# EAGLE schematic design (EAGLE 7.7.0)

## Sheet 1 of 17
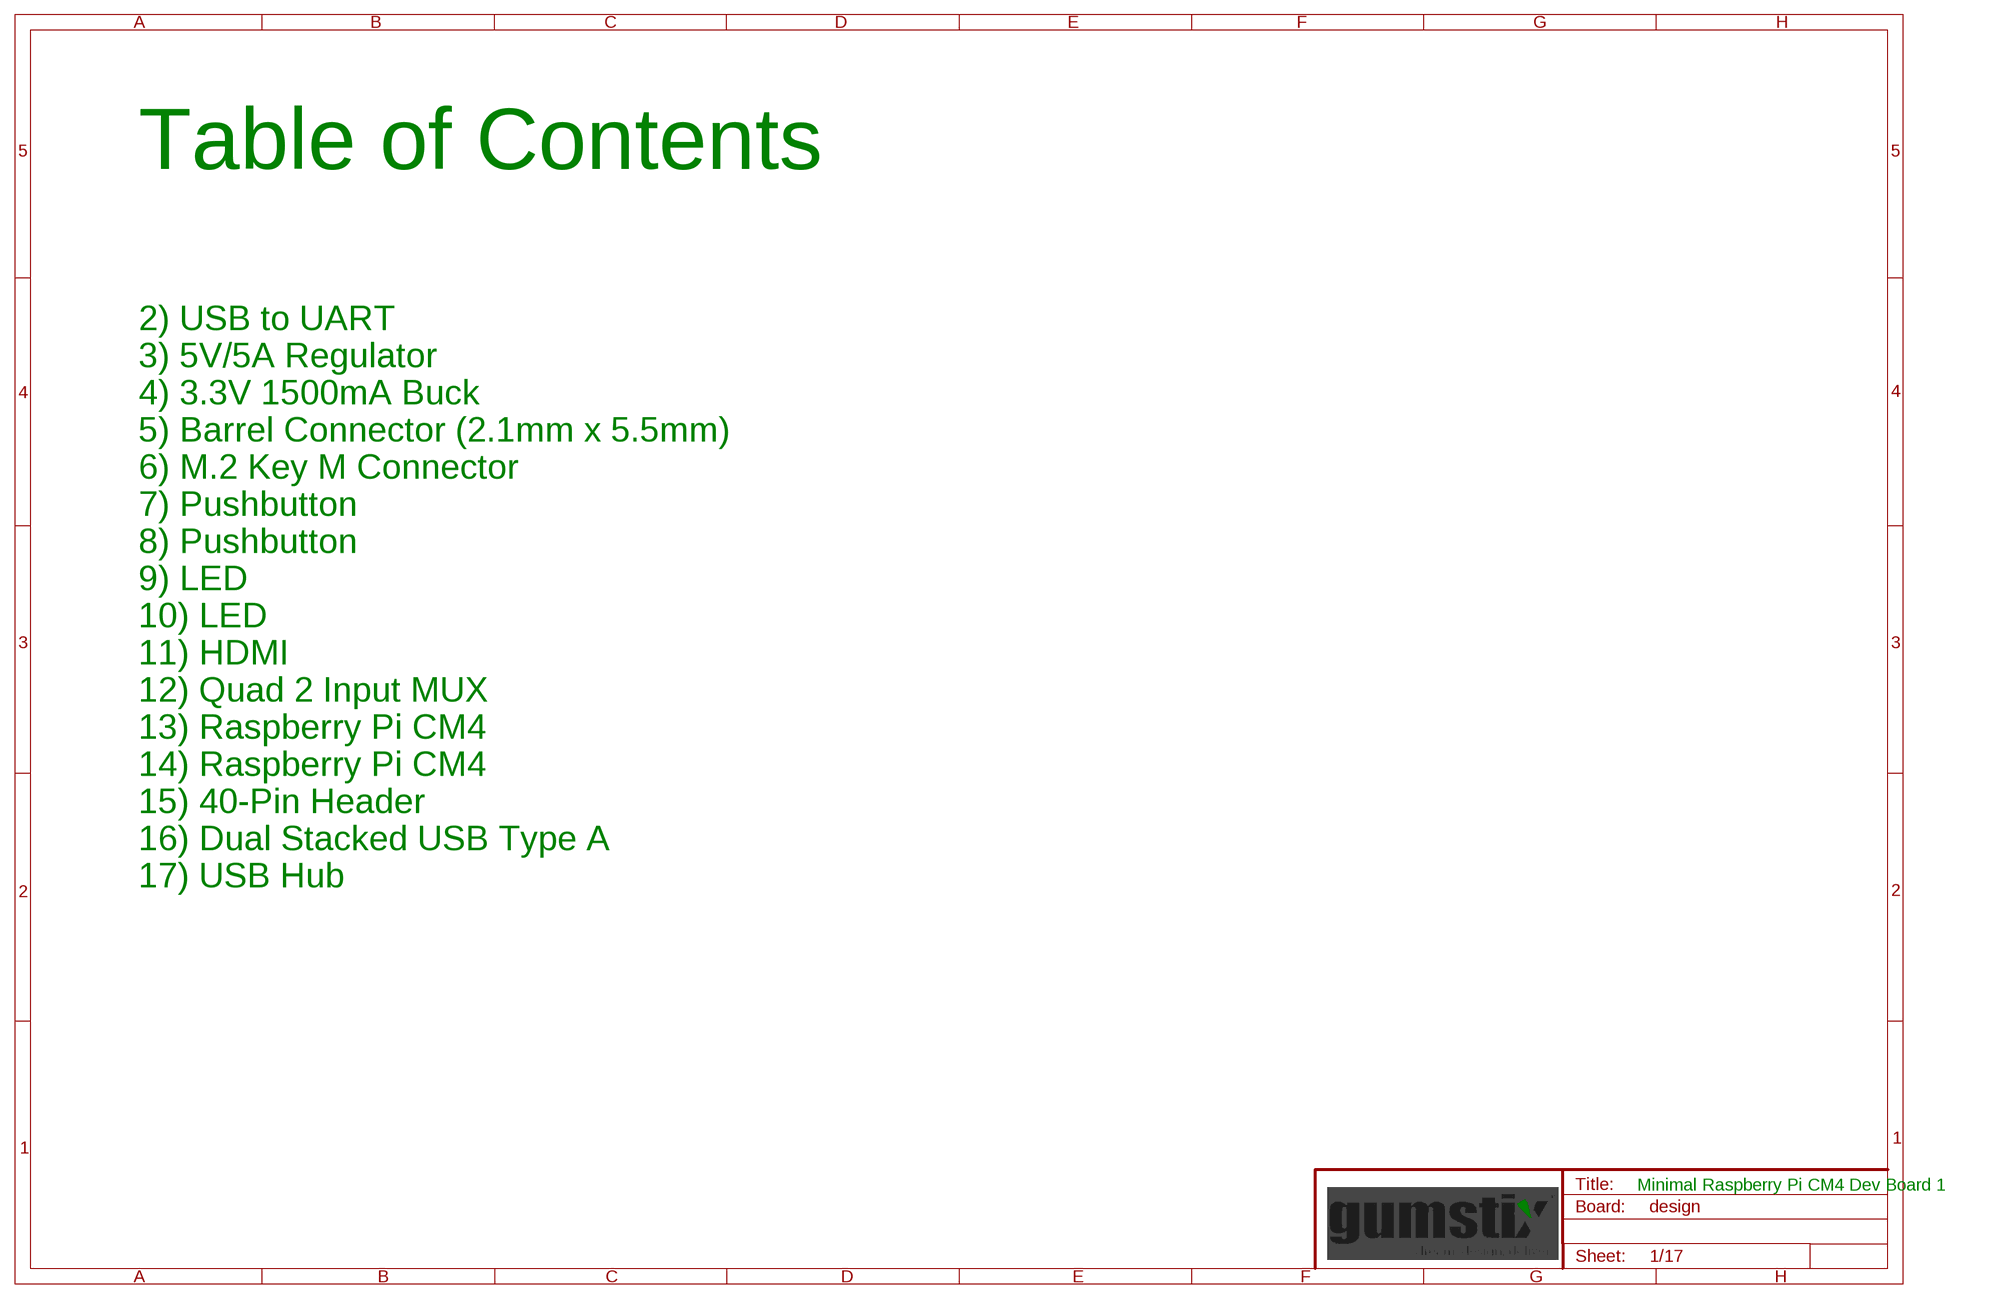
[diagram p0: schematic, sheet 1]

### Notes on the sheet
- Table of Contents
- 2) USB to UART
- 3) 5V/5A Regulator
- 4) 3.3V 1500mA Buck
- 5) Barrel Connector (2.1mm x 5.5mm)
- 6) M.2 Key M Connector
- 7) Pushbutton
- 8) Pushbutton
- 9) LED
- 10) LED
- 11) HDMI
- 12) Quad 2 Input MUX
- 13) Raspberry Pi CM4
- 14) Raspberry Pi CM4
- 15) 40-Pin Header
- 16) Dual Stacked USB Type A
- 17) USB Hub
- Minimal Raspberry Pi CM4 Dev Board 1

## Sheet 2 of 17
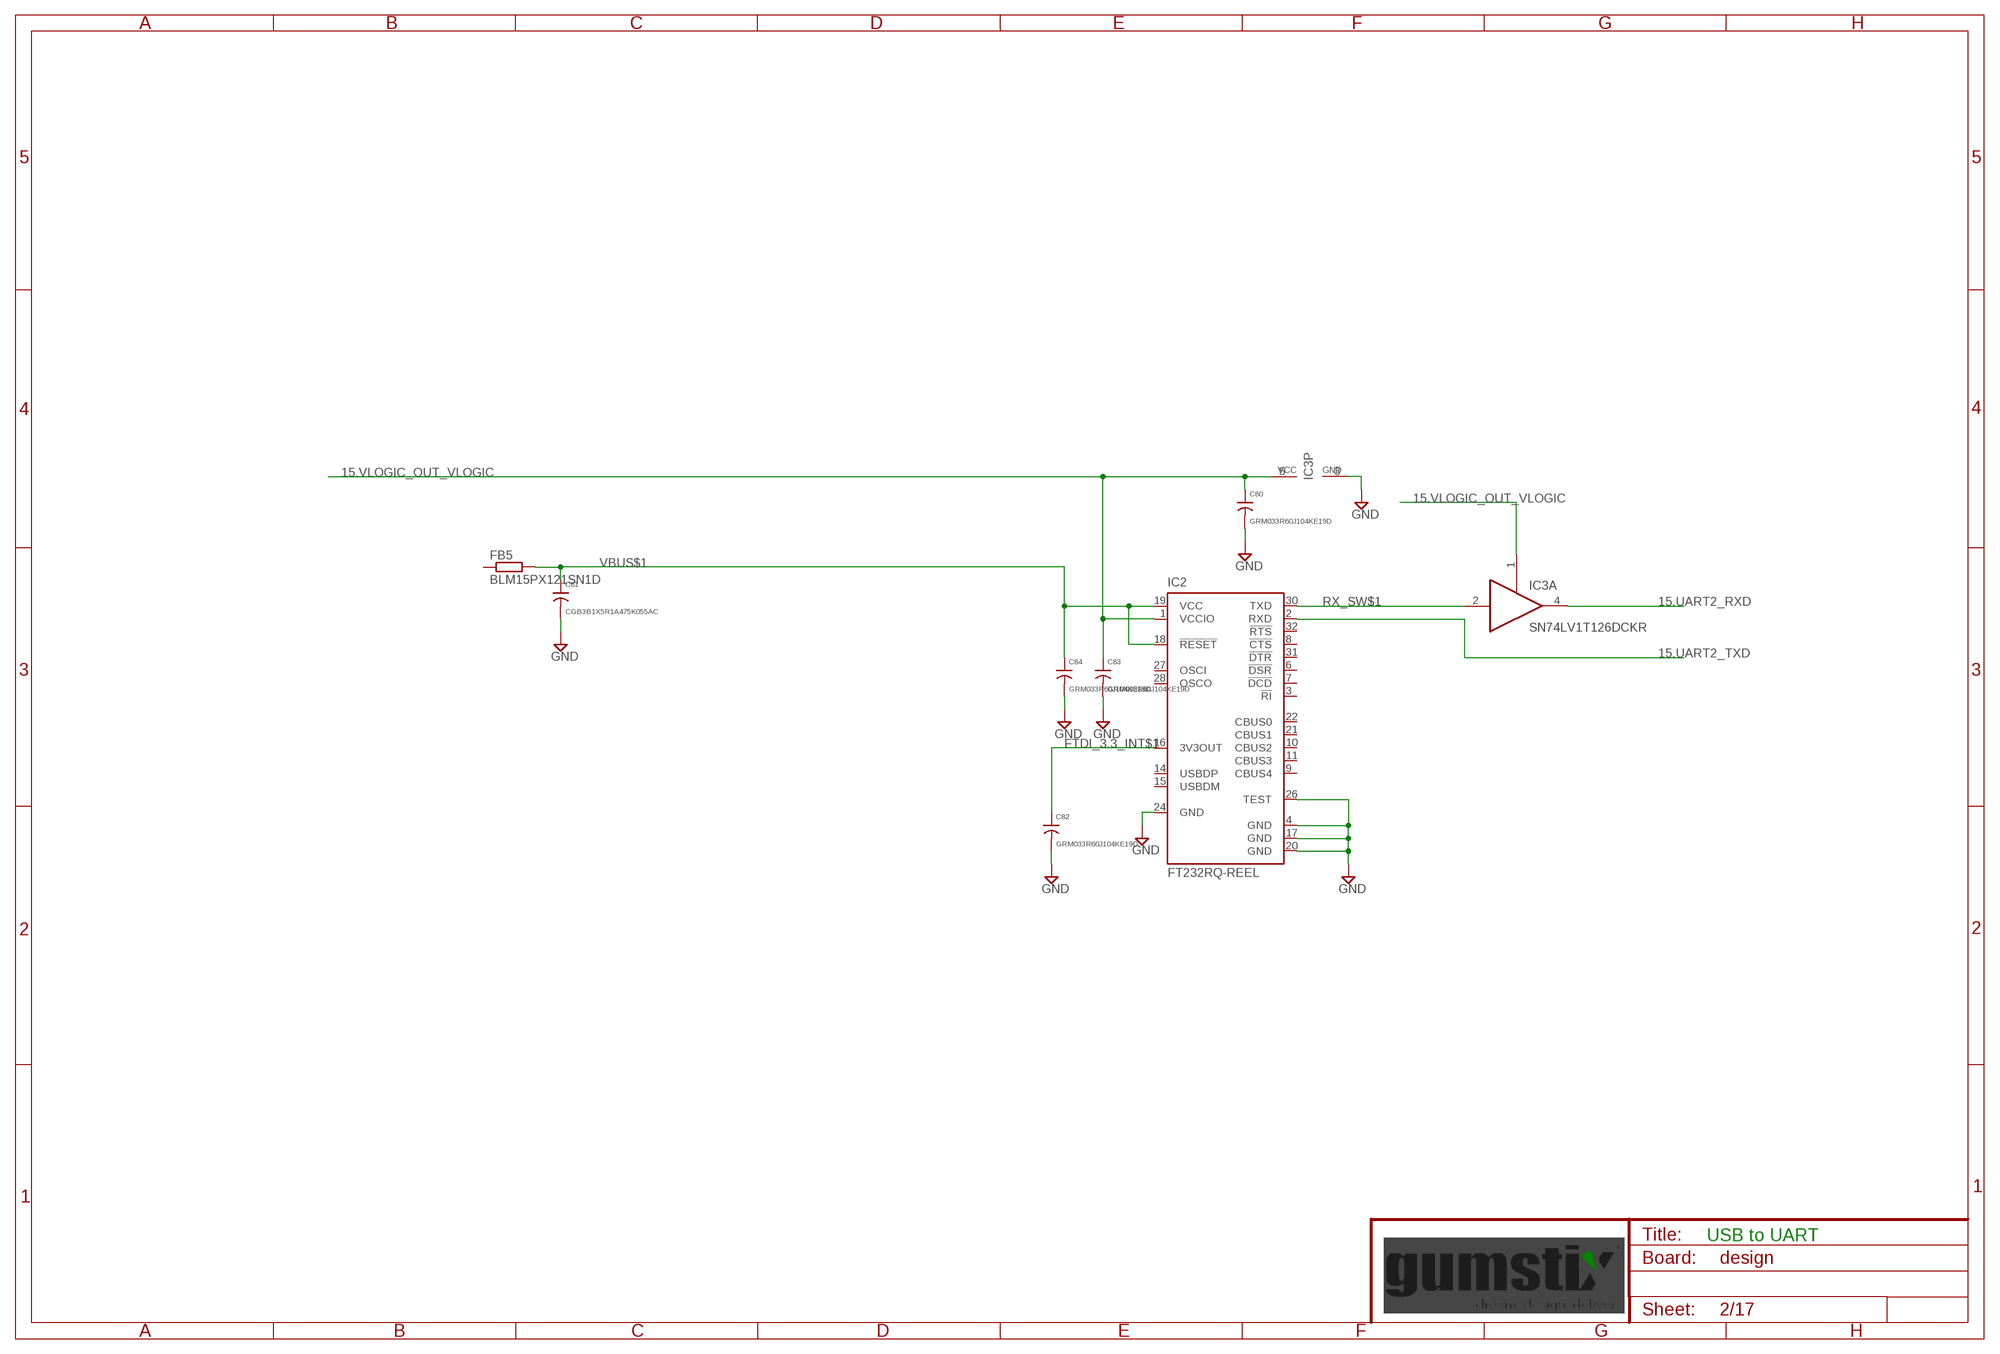
[diagram p1: schematic, sheet 2]

### Parts
C80  GRM033R60J104KE19D  [0201]
C81  CGB3B1X5R1A475K055AC  [0603]
C82  GRM033R60J104KE19D  [0201]
C83  GRM033R60J104KE19D  [0201]
C84  GRM033R60J104KE19D  [0201]
FB5  BLM15PX121SN1D  [0402]
IC2  FT232RQ-REEL  [QFN32]
IC3  SN74LV1T126DCKR  [SC70-5]

### Nets
15.UART2_RXD: IC3.4(A:O) ; also sheet 12
15.UART2_TXD: IC2.2(RXD) ; also sheet 12
15.VLOGIC_OUT_VLOGIC [supply]: C80.1 C83.1 IC2.1(VCCIO) IC3.1(A:OE) IC3.5(P:VCC) ; also sheet 12
FTDI_3.3_INT$1 [supply]: C82.1 IC2.16(3V3OUT)
GND [supply]: C80.2 C81.2 C82.2 C83.2 C84.2 IC2.4(GND) IC2.17(GND) IC2.20(GND) IC2.24(GND) IC2.26(TEST) IC3.3(P:GND) ; also sheet 3,4,5,6,7,8,9,10,11,12,13,14,15,16,17
RX_SW$1: IC2.30(TXD) IC3.2(A:I)
VBUS$1 [supply]: C81.1 C84.1 FB5.2 IC2.18(!RESET) IC2.19(VCC)
Unconnected: FB5.1 IC2.3(!RI) IC2.6(!DSR) IC2.7(!DCD) IC2.8(!CTS) IC2.9(CBUS4) IC2.10(CBUS2) IC2.11(CBUS3) IC2.14(USBDP) IC2.15(USBDM) IC2.21(CBUS1) IC2.22(CBUS0) IC2.27(OSCI) IC2.28(OSCO) IC2.31(!DTR) IC2.32(!RTS)

### Notes on the sheet
- USB to UART

## Sheet 3 of 17
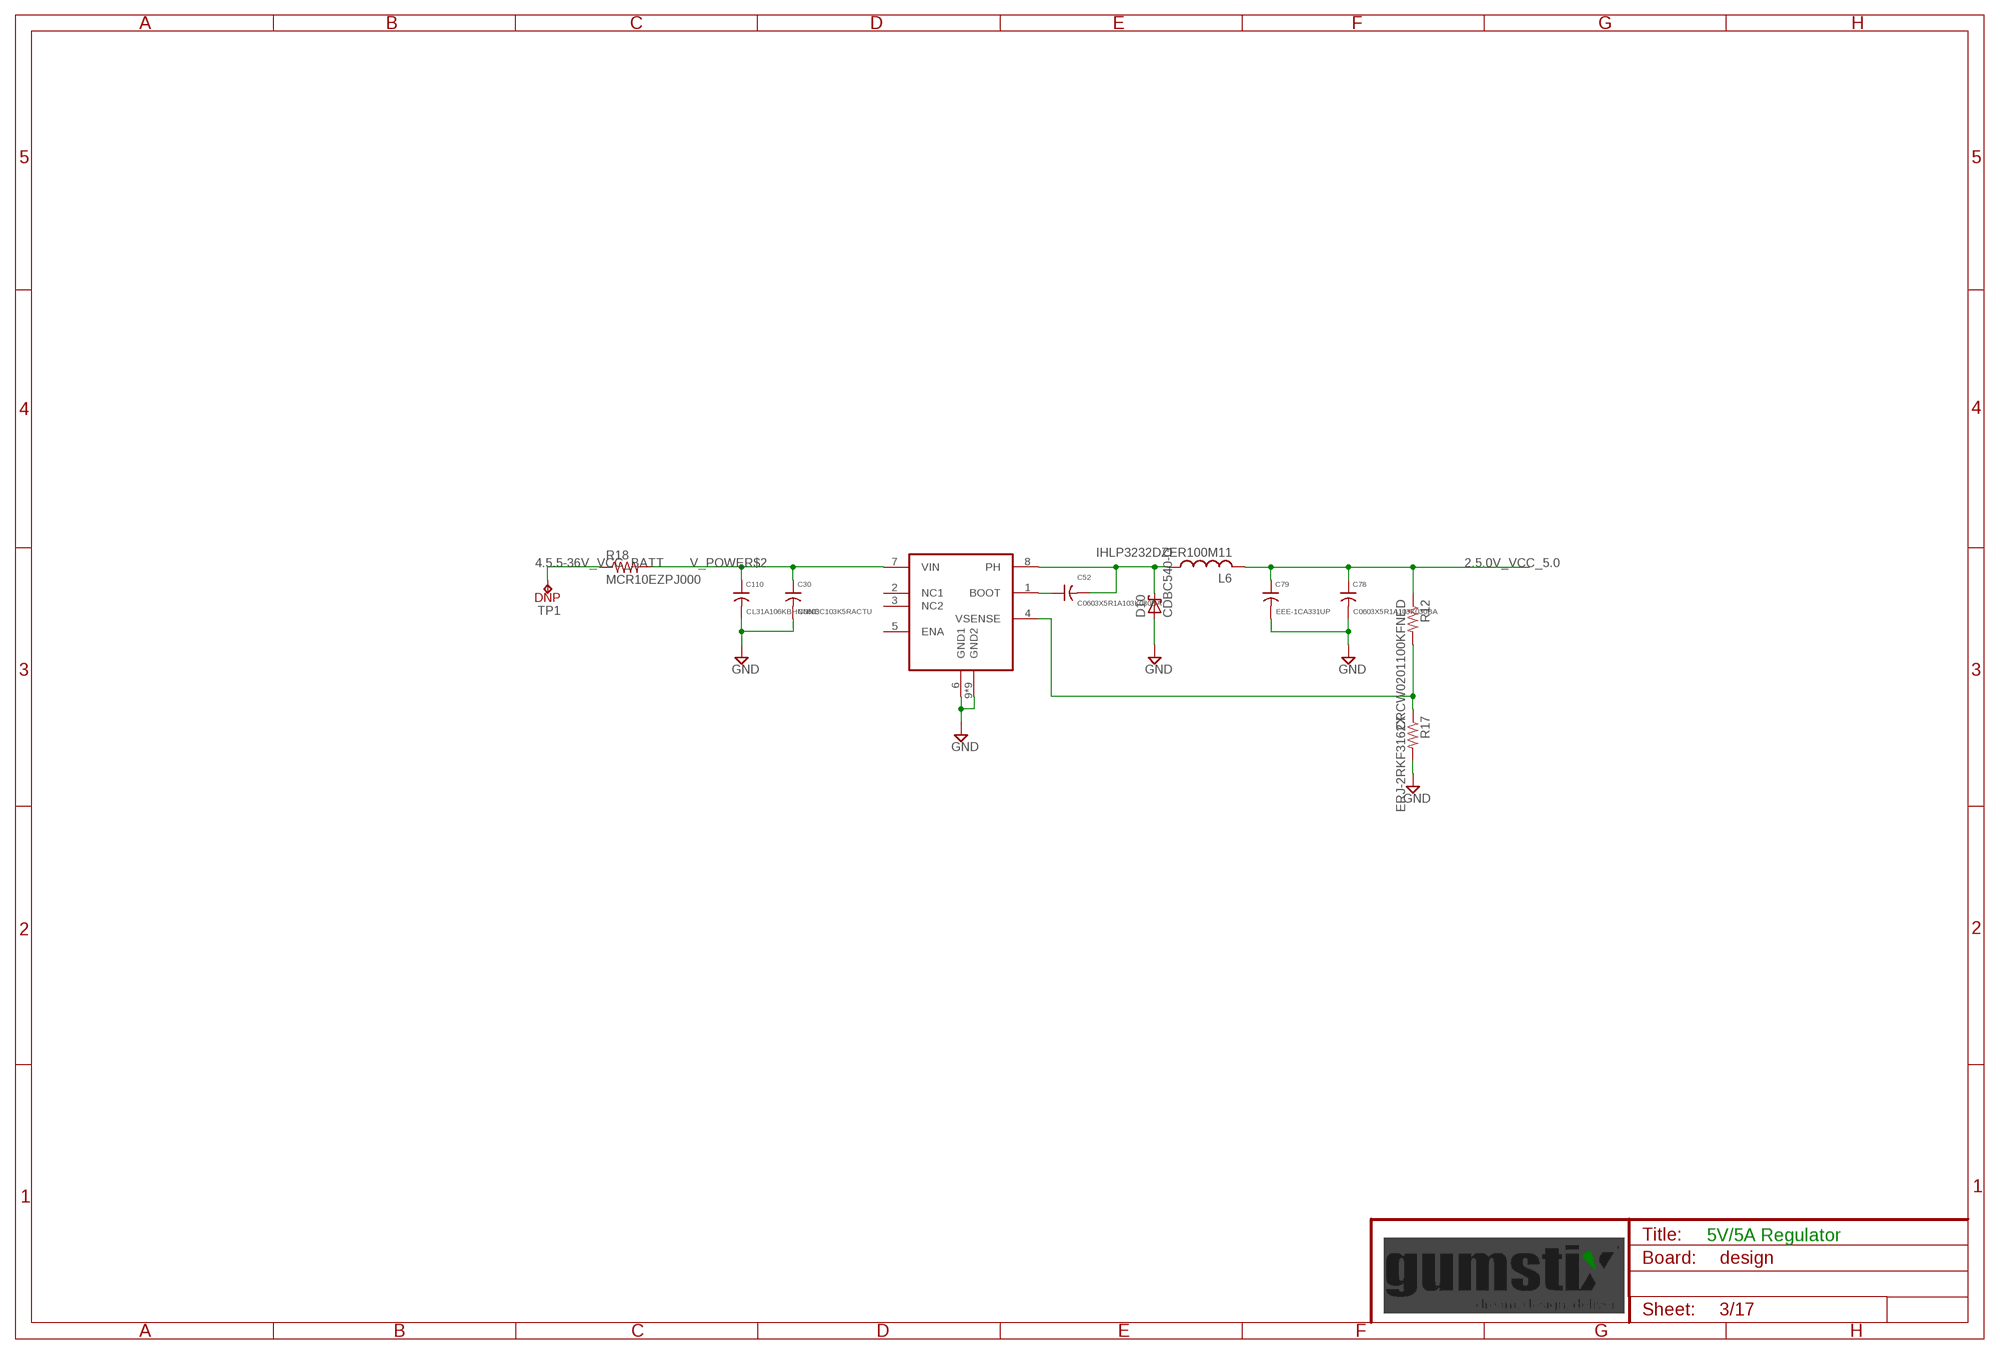
[diagram p2: schematic, sheet 3]

### Parts
C30  C0603C103K5RACTU  [0603]
C52  C0603X5R1A103K030BA  [0201]
C78  C0603X5R1A103K030BA  [0201]
C79  EEE-1CA331UP  [PANASONIC_F]
C110  CL31A106KBHNNNE  [1206]
D10  CDBC540-G  [DO-214AB]
L6  IHLP3232DZER100M11  [3232DZ]
R12  CRCW0201100KFNED  [0201]
R17  ERJ-2RKF3162X  [0402]
R18  MCR10EZPJ000  [0805]
TP1  DNP  TP05  [TP0500]
U6  TPS5450QDDARQ1  [8SO_POWERPAD]

### Nets
2.5.0V_VCC_5.0 [supply]: C78.1 C79.+ L6.2 R12.1 ; also sheet 4,11,13,15,16,17
4.5.5-36V_VCC_BATT [supply]: R18.1 TP1.1(TP) ; also sheet 5
BOOT$2 [supply]: C52.1 U6.1(BOOT)
GND [supply]: C30.2 C78.2 C79.- C110.2 D10.A R17.2 U6.6(GND1) U6.9(GND2) U6.PWRPAD1(GND2) U6.PWRPAD2(GND2) U6.PWRPAD3(GND2) U6.PWRPAD4(GND2) U6.PWRPAD5(GND2) U6.PWRPAD6(GND2) U6.PWRPAD7(GND2) U6.PWRPAD8(GND2) ; also sheet 2,4,5,6,7,8,9,10,11,12,13,14,15,16,17
PH$2 [supply]: C52.2 D10.C L6.1 U6.8(PH)
V_POWER$2 [supply]: C30.1 C110.1 R18.2 U6.7(VIN)
VSENSE$2 [supply]: R12.2 R17.1 U6.4(VSENSE)
Unconnected: U6.2(NC1) U6.3(NC2) U6.5(ENA)

### Notes on the sheet
- 5V/5A Regulator

## Sheet 4 of 17
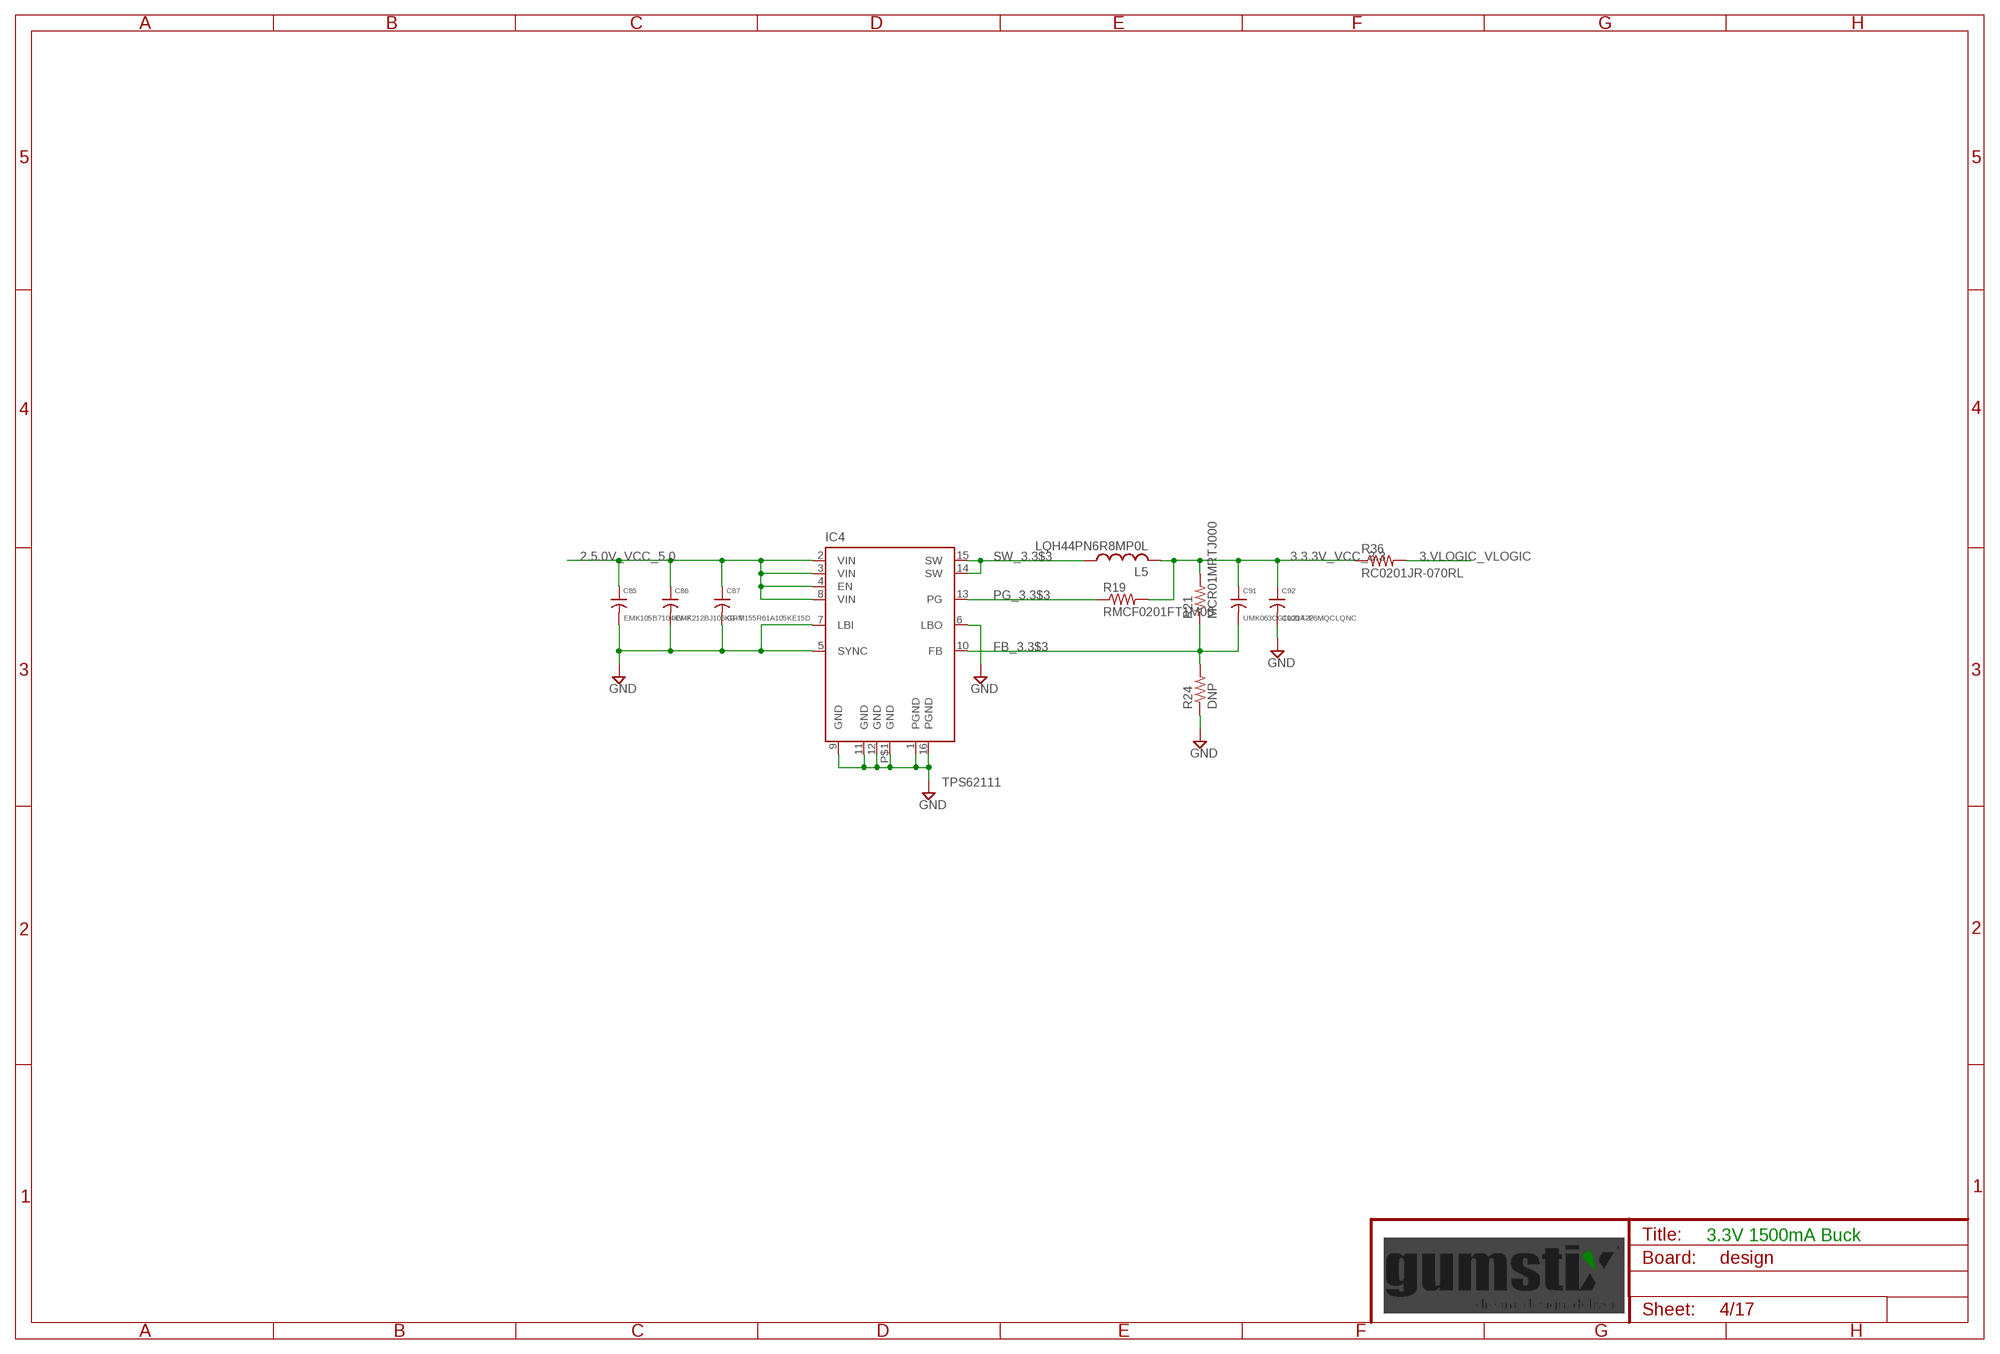
[diagram p3: schematic, sheet 4]

### Parts
C85  EMK105B7104KV-F  [0402]
C86  EMK212BJ106KG-T  [0805]
C87  GRM155R61A105KE15D  [0402]
C91  UMK063CG100DT-F  [0201]
C92  CL21A226MQCLQNC  [0805]
IC4  TPS62111  [PQFP16]
L5  LQH44PN6R8MP0L  [1515]
R19  RMCF0201FT1M00  [0201]
R21  MCR01MRTJ000  [0402]
R24  DNP  R0402  [0402]
R36  RC0201JR-070RL  [0201]

### Nets
2.5.0V_VCC_5.0 [supply]: C85.1 C86.1 C87.1 IC4.2(VIN) IC4.3(VIN) IC4.4(EN) IC4.8(VIN) ; also sheet 3,11,13,15,16,17
3.3.3V_VCC_3.3 [supply]: C91.1 C92.1 L5.2 R19.2 R21.2 R36.1 ; also sheet 6,9,10,15
3.VLOGIC_VLOGIC [50_OHM]: R36.2 ; also sheet 15
FB_3.3$3 [supply]: C91.2 IC4.10(FB) R21.1 R24.2
GND [supply]: C85.2 C86.2 C87.2 C92.2 IC4.1(PGND) IC4.5(SYNC) IC4.6(LBO) IC4.7(LBI) IC4.9(GND) IC4.11(GND) IC4.12(GND) IC4.16(PGND) IC4.P$1(GND) R24.1 ; also sheet 2,3,5,6,7,8,9,10,11,12,13,14,15,16,17
PG_3.3$3: IC4.13(PG) R19.1
SW_3.3$3 [supply]: IC4.14(SW) IC4.15(SW) L5.1

### Notes on the sheet
- 3.3V 1500mA Buck

## Sheet 5 of 17
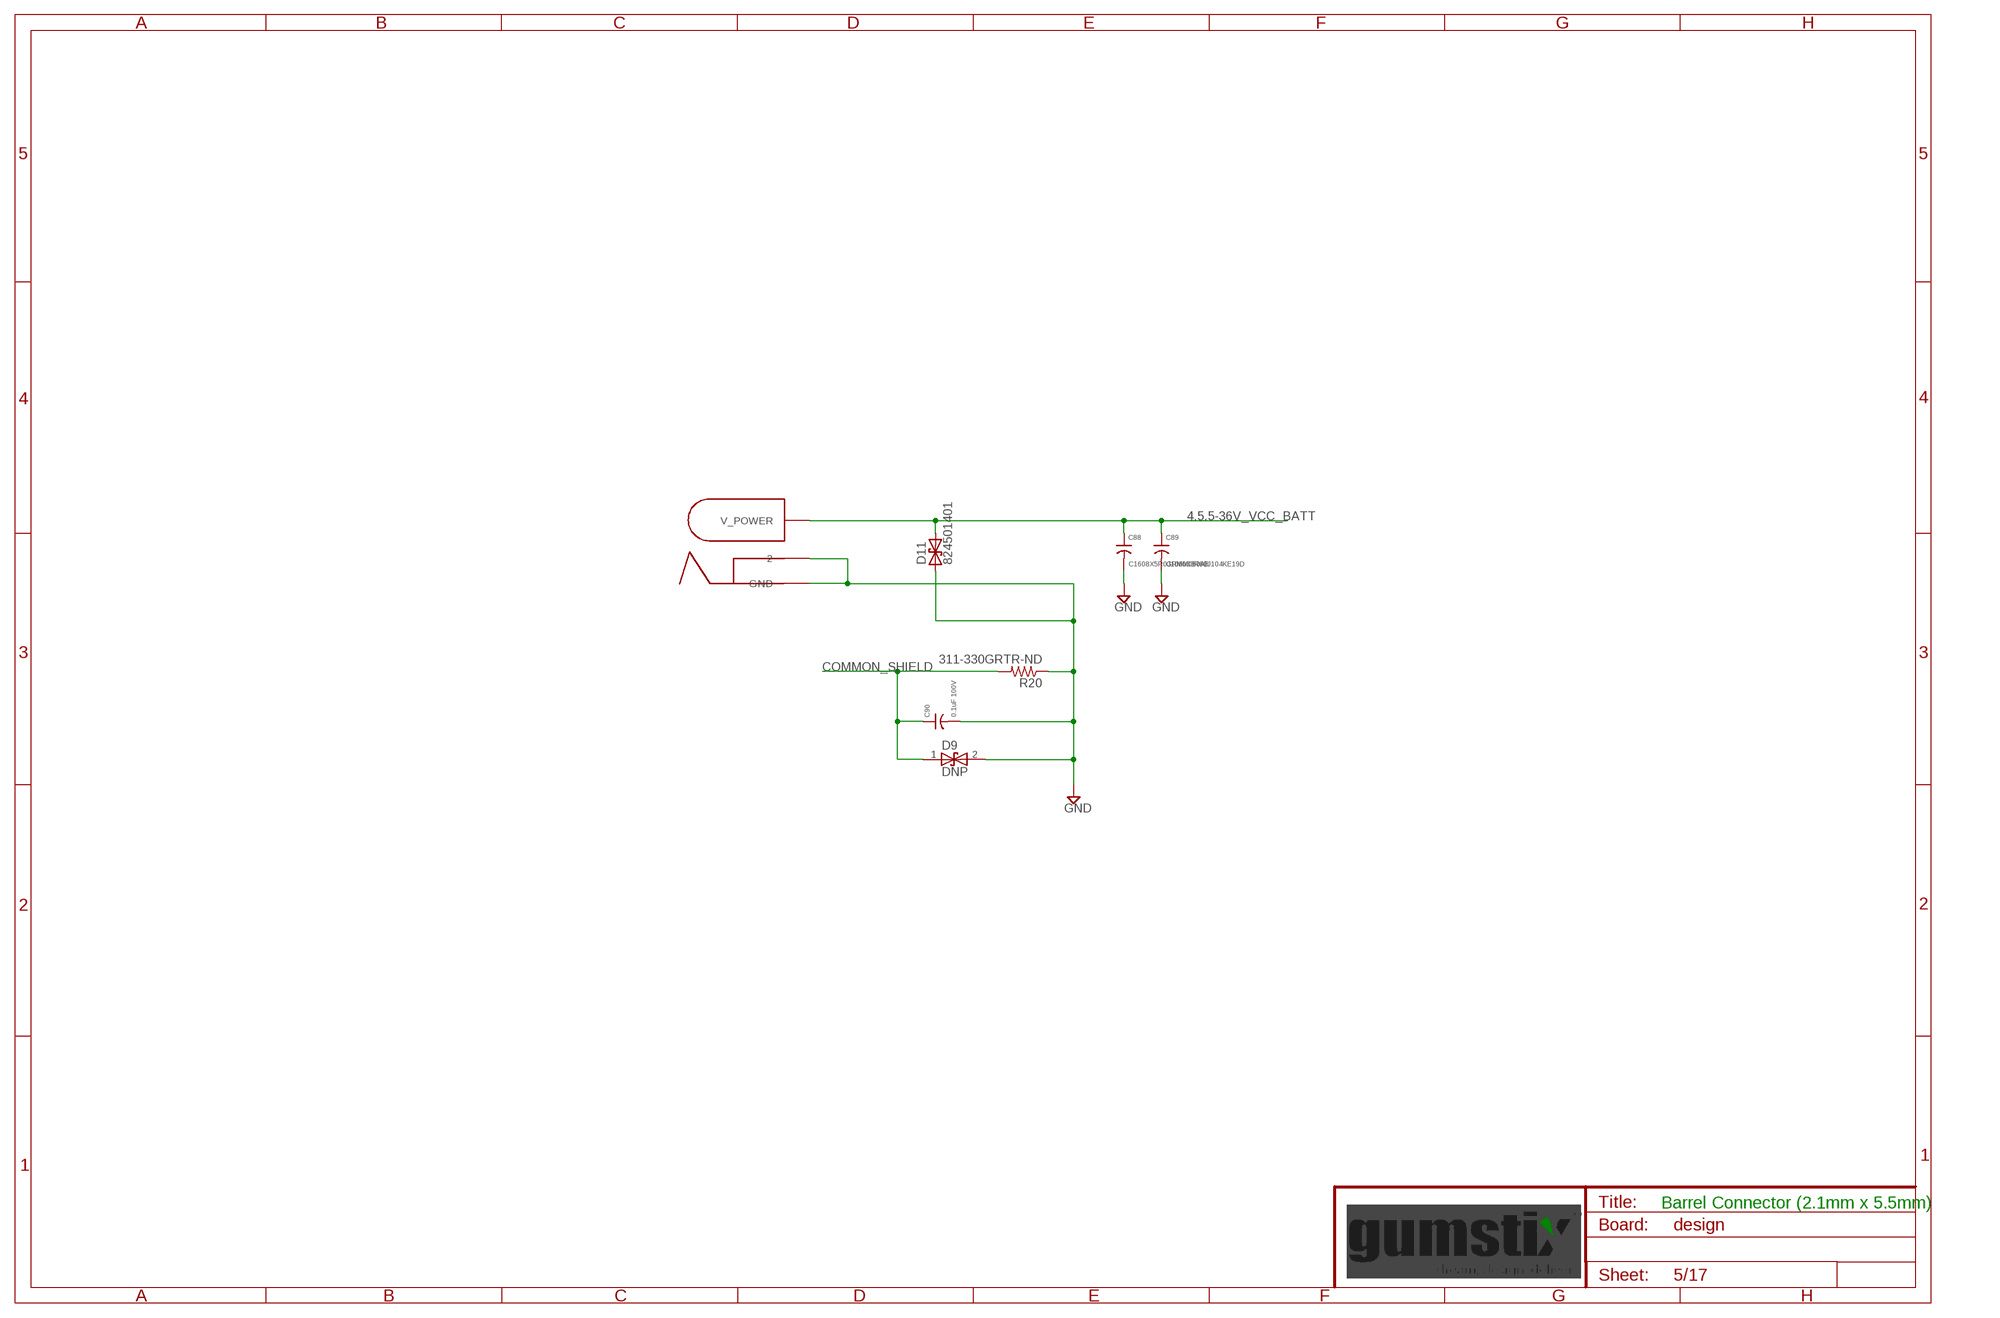
[diagram p4: schematic, sheet 5]

### Parts
C88  C1608X5R0J106M080AB  [0603]
C89  GRM033R60J104KE19D  [0201]
C90  0.1uF 100V  C1206  [1206]
D9  DNP  TPD1E10B06  [TPD1E]
D11  824501401  [SMAJ]
J3  PJ-002AH  [PJ-002A]
R20  311-330GRTR-ND  [0603]

### Nets
4.5.5-36V_VCC_BATT [supply]: C88.1 C89.1 D11.C J3.1(V_POWER) ; also sheet 3
COMMON_SHIELD [supply]: C90.1 D9.1 R20.2 ; also sheet 11,16
GND [supply]: C88.2 C89.2 C90.2 D9.2 D11.A J3.2(GND) J3.3 R20.1 ; also sheet 2,3,4,6,7,8,9,10,11,12,13,14,15,16,17

### Notes on the sheet
- Barrel Connector (2.1mm x 5.5mm)

## Sheet 6 of 17
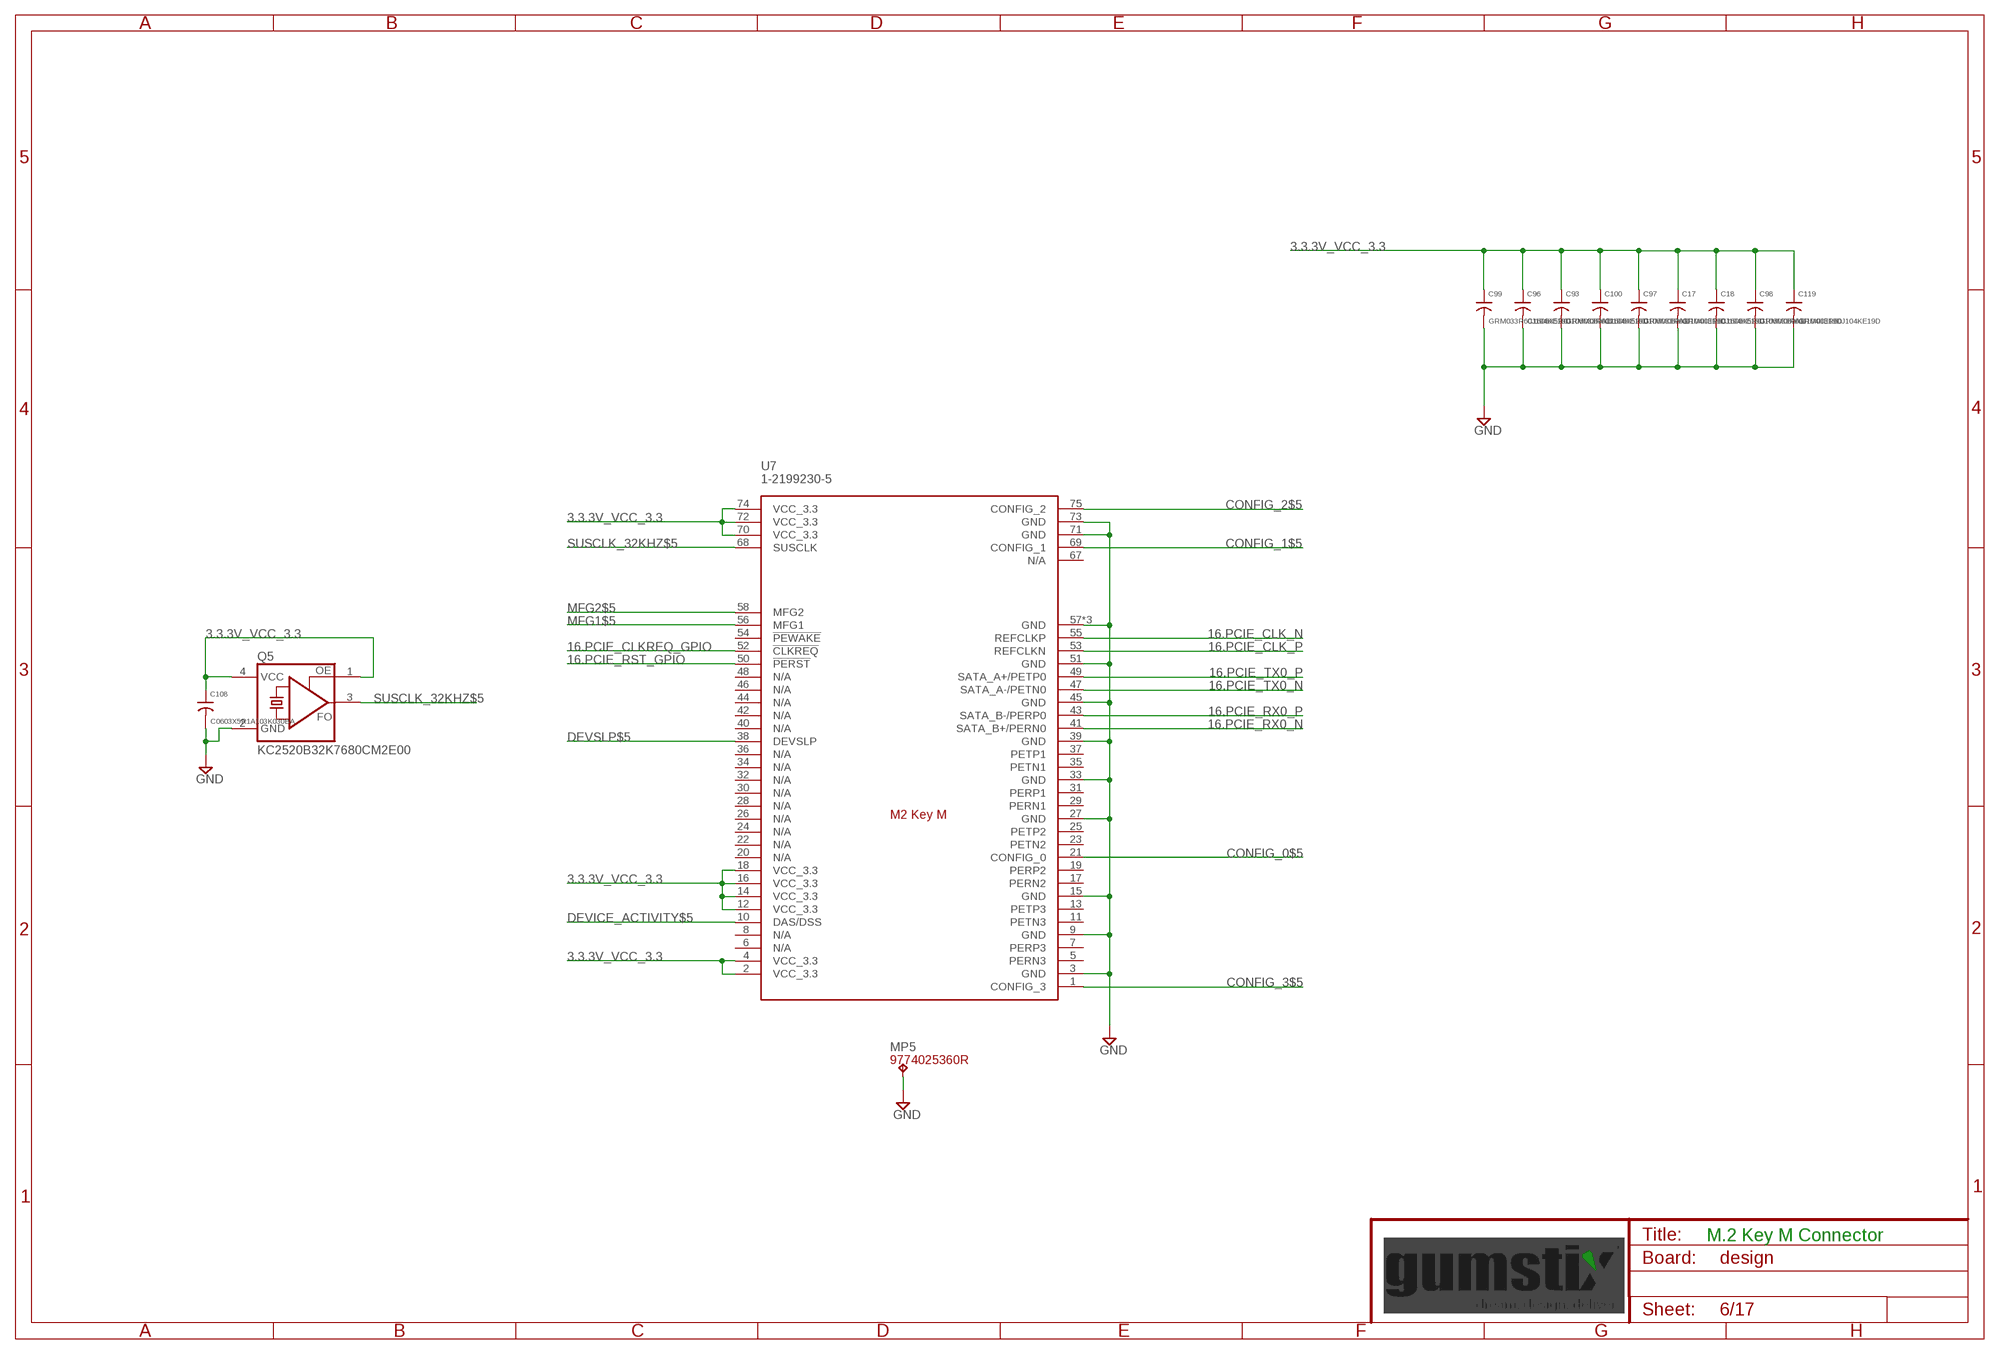
[diagram p5: schematic, sheet 6]

### Parts
C17  GRM033R60J104KE19D  [0201]
C18  C1608X5R0J106M080AB  [0603]
C93  GRM033R60J104KE19D  [0201]
C96  C1608X5R0J106M080AB  [0603]
C97  GRM033R60J104KE19D  [0201]
C98  GRM033R60J104KE19D  [0201]
C99  GRM033R60J104KE19D  [0201]
C100  C1608X5R0J106M080AB  [0603]
C108  C0603X5R1A103K030BA  [0201]
C119  GRM033R60J104KE19D  [0201]
MP5  9774025360R  BULLET_CONN3MM  [WA-SMSI_9774___360]
Q5  KC2520B32K7680CM2E00  [VLGA-4]
U7  1-2199230-5  [2199230_KEY_M]

### Nets
3.3.3V_VCC_3.3 [supply]: C17.1 C18.1 C93.1 C96.1 C97.1 C98.1 C99.1 C100.1 C108.1 C119.1 Q5.1(OE) Q5.4(VCC) U7.2(VCC_3.3) U7.4(VCC_3.3) U7.12(VCC_3.3) U7.14(VCC_3.3) U7.16(VCC_3.3) U7.18(VCC_3.3) U7.70(VCC_3.3) U7.72(VCC_3.3) U7.74(VCC_3.3) ; also sheet 4,9,10,15
16.PCIE_CLK_N [USB]: U7.55(REFCLKP) ; also sheet 13
16.PCIE_CLK_P [USB]: U7.53(REFCLKN) ; also sheet 13
16.PCIE_CLKREQ_GPIO: U7.52(!CLKREQ) ; also sheet 13
16.PCIE_RST_GPIO: U7.50(!PERST) ; also sheet 13
16.PCIE_RX0_N [USB]: U7.41(SATA_B+/PERN0) ; also sheet 13
16.PCIE_RX0_P [USB]: U7.43(SATA_B-/PERP0) ; also sheet 13
16.PCIE_TX0_N [USB]: U7.47(SATA_A-/PETN0) ; also sheet 13
16.PCIE_TX0_P [USB]: U7.49(SATA_A+/PETP0) ; also sheet 13
CONFIG_0$5: U7.21(CONFIG_0)
CONFIG_1$5: U7.69(CONFIG_1)
CONFIG_2$5: U7.75(CONFIG_2)
CONFIG_3$5: U7.1(CONFIG_3)
DEVICE_ACTIVITY$5 [supply]: U7.10(DAS/DSS)
DEVSLP$5: U7.38(DEVSLP)
GND [supply]: C17.2 C18.2 C93.2 C96.2 C97.2 C98.2 C99.2 C100.2 C108.2 C119.2 MP5.1(TP) Q5.2(GND) U7.3(GND) U7.9(GND) U7.15(GND) U7.27(GND) U7.33(GND) U7.39(GND) U7.45(GND) U7.51(GND) U7.57(GND) U7.71(GND) U7.73(GND) U7.P$1(GND) U7.P$2(GND) ; also sheet 2,3,4,5,7,8,9,10,11,12,13,14,15,16,17
MFG1$5: U7.56(MFG1)
MFG2$5: U7.58(MFG2)
SUSCLK_32KHZ$5: Q5.3(FO) U7.68(SUSCLK)
Unconnected: U7.5(PERN3) U7.6(N/A) U7.7(PERP3) U7.8(N/A) U7.11(PETN3) U7.13(PETP3) U7.17(PERN2) U7.19(PERP2) U7.20(N/A) U7.22(N/A) U7.23(PETN2) U7.24(N/A) U7.25(PETP2) U7.26(N/A) U7.28(N/A) U7.29(PERN1) U7.30(N/A) U7.31(PERP1) U7.32(N/A) U7.34(N/A) U7.35(PETN1) U7.36(N/A) U7.37(PETP1) U7.40(N/A) U7.42(N/A) U7.44(N/A) U7.46(N/A) U7.48(N/A) U7.54(!PEWAKE) U7.67(N/A)

### Notes on the sheet
- M.2 Key M Connector

## Sheet 7 of 17
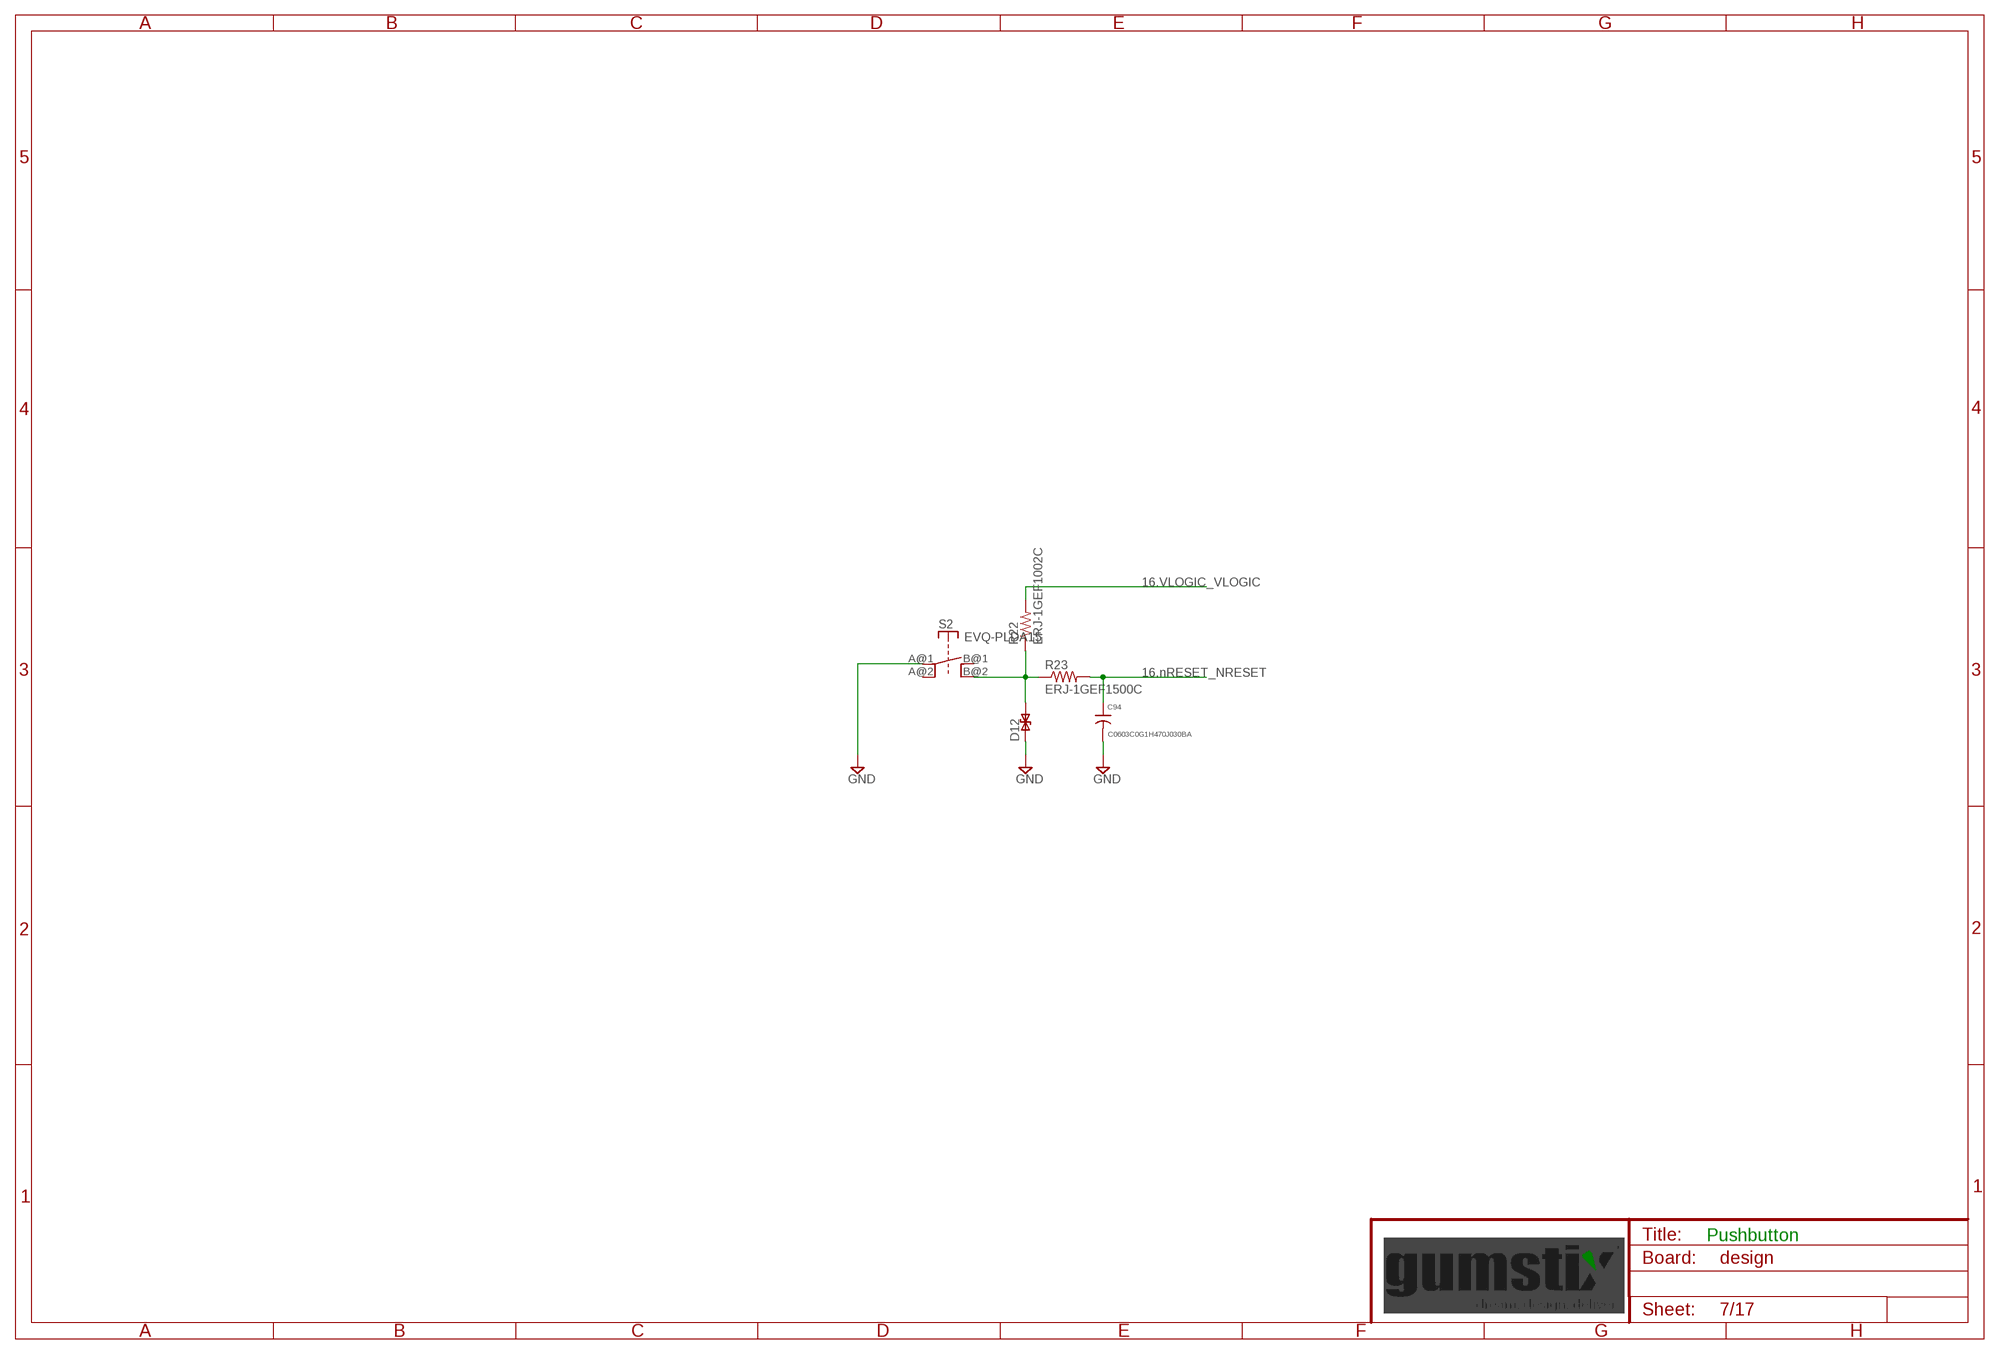
[diagram p6: schematic, sheet 7]

### Parts
C94  C0603C0G1H470J030BA  [0201]
D12  B72590D0050A060  [D0402]
R22  ERJ-1GEF1002C  [0201]
R23  ERJ-1GEF1500C  [0201]
S2  EVQ-PLDA15  [EVQ]

### Nets
16.nRESET_NRESET: C94.1 R23.2 ; also sheet 13
16.VLOGIC_VLOGIC [supply]: R22.2 ; also sheet 8,11,12,13
BTN_A$10: D12.P2 R22.1 R23.1 S2.B@2(B')
GND [supply]: C94.2 D12.P1 S2.A@1(A) ; also sheet 2,3,4,5,6,8,9,10,11,12,13,14,15,16,17
Unconnected: S2.A@2(A') S2.B@1(B)

### Notes on the sheet
- Pushbutton

## Sheet 8 of 17
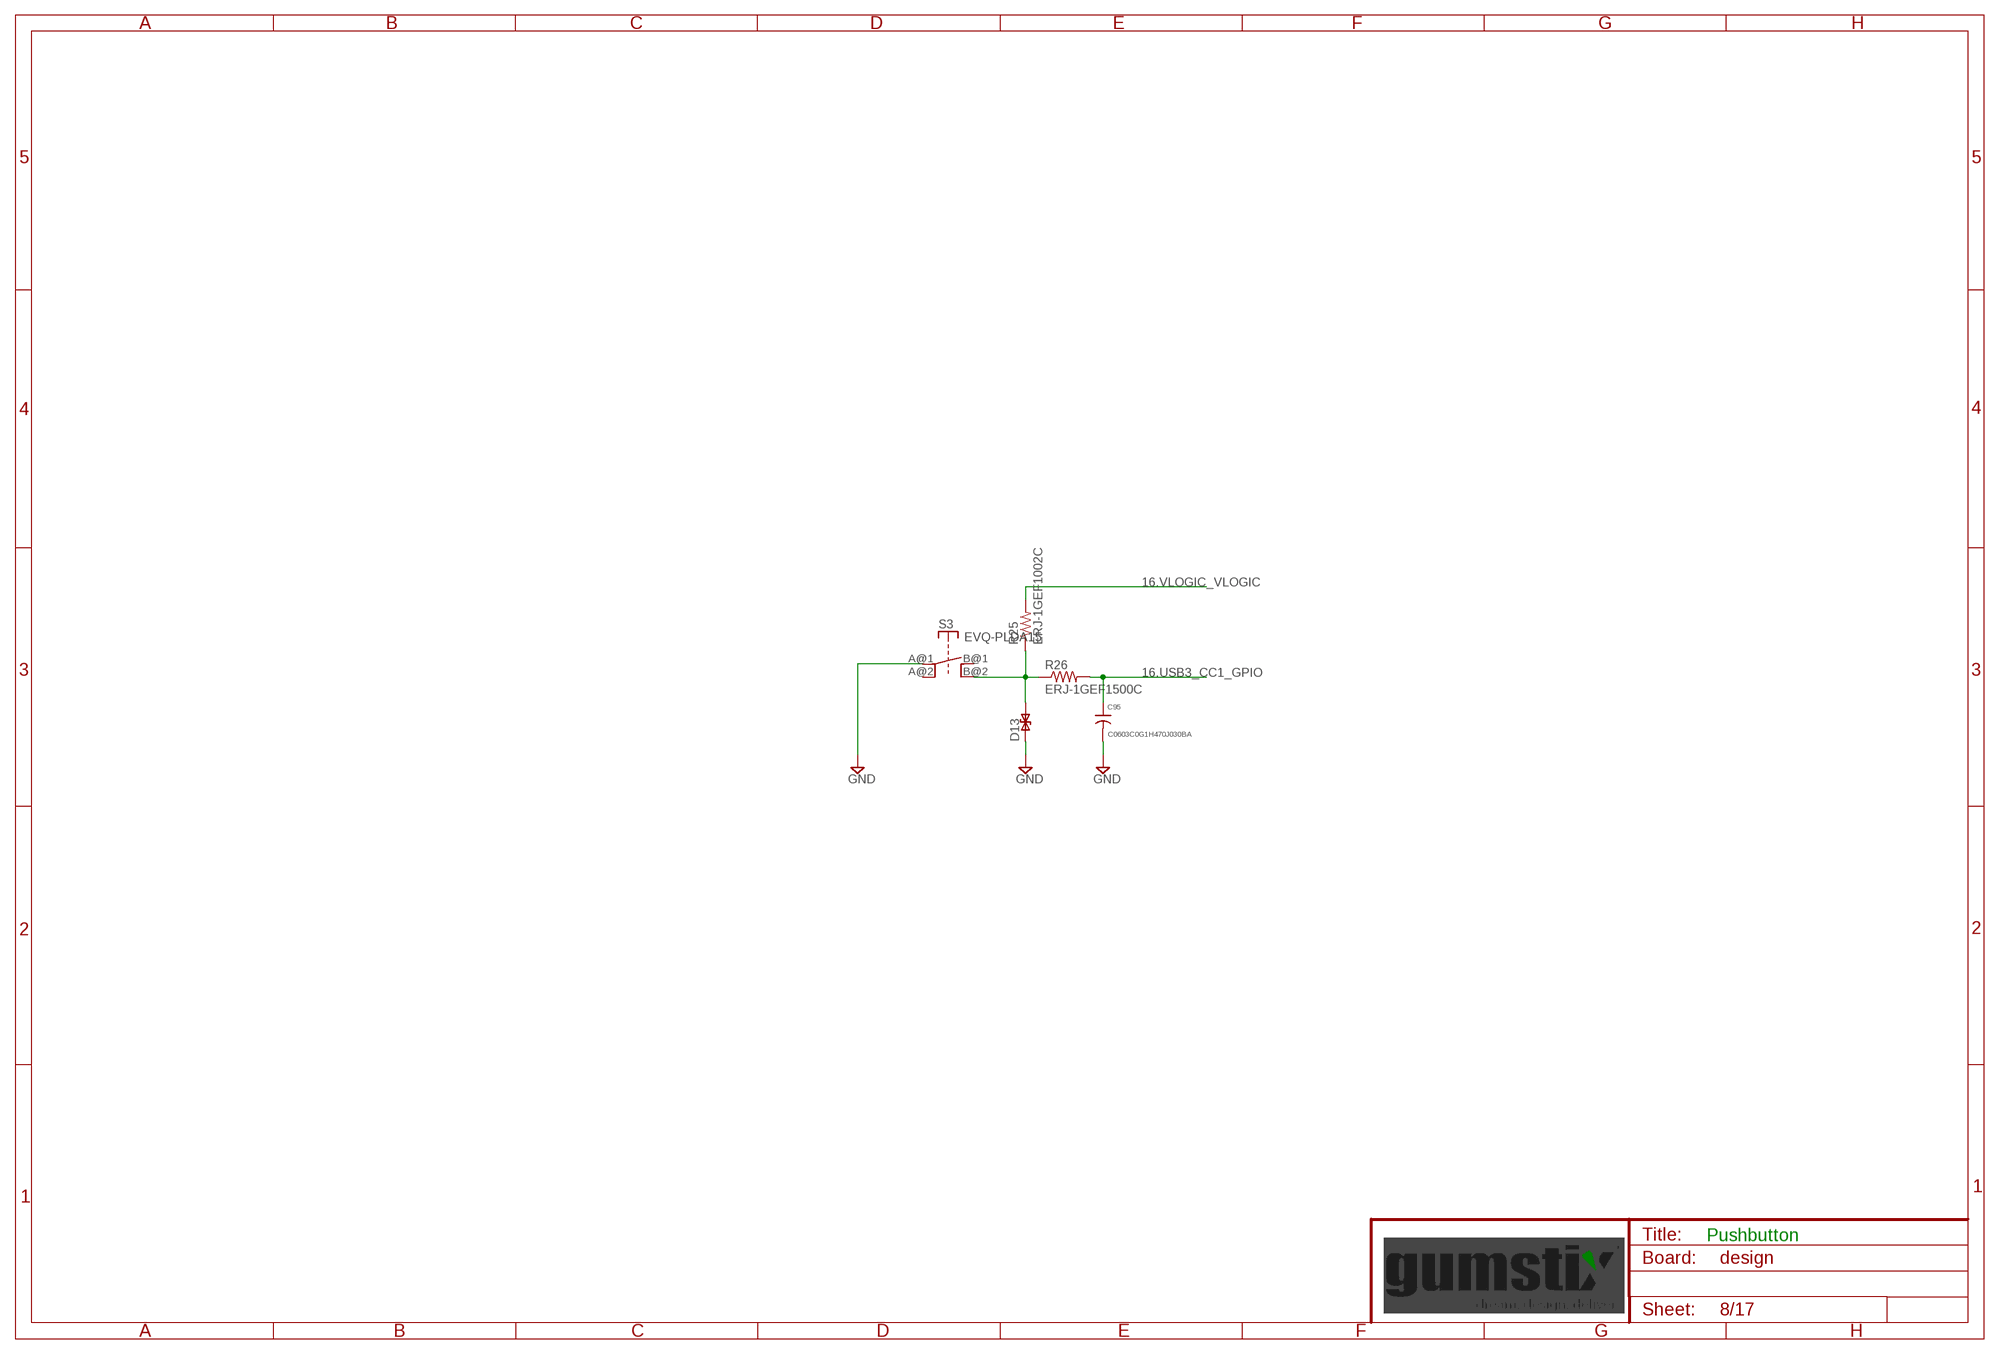
[diagram p7: schematic, sheet 8]

### Parts
C95  C0603C0G1H470J030BA  [0201]
D13  B72590D0050A060  [D0402]
R25  ERJ-1GEF1002C  [0201]
R26  ERJ-1GEF1500C  [0201]
S3  EVQ-PLDA15  [EVQ]

### Nets
16.USB3_CC1_GPIO: C95.1 R26.2 ; also sheet 13
16.VLOGIC_VLOGIC [supply]: R25.2 ; also sheet 7,11,12,13
BTN_A$11: D13.P2 R25.1 R26.1 S3.B@2(B')
GND [supply]: C95.2 D13.P1 S3.A@1(A) ; also sheet 2,3,4,5,6,7,9,10,11,12,13,14,15,16,17
Unconnected: S3.A@2(A') S3.B@1(B)

### Notes on the sheet
- Pushbutton

## Sheet 9 of 17
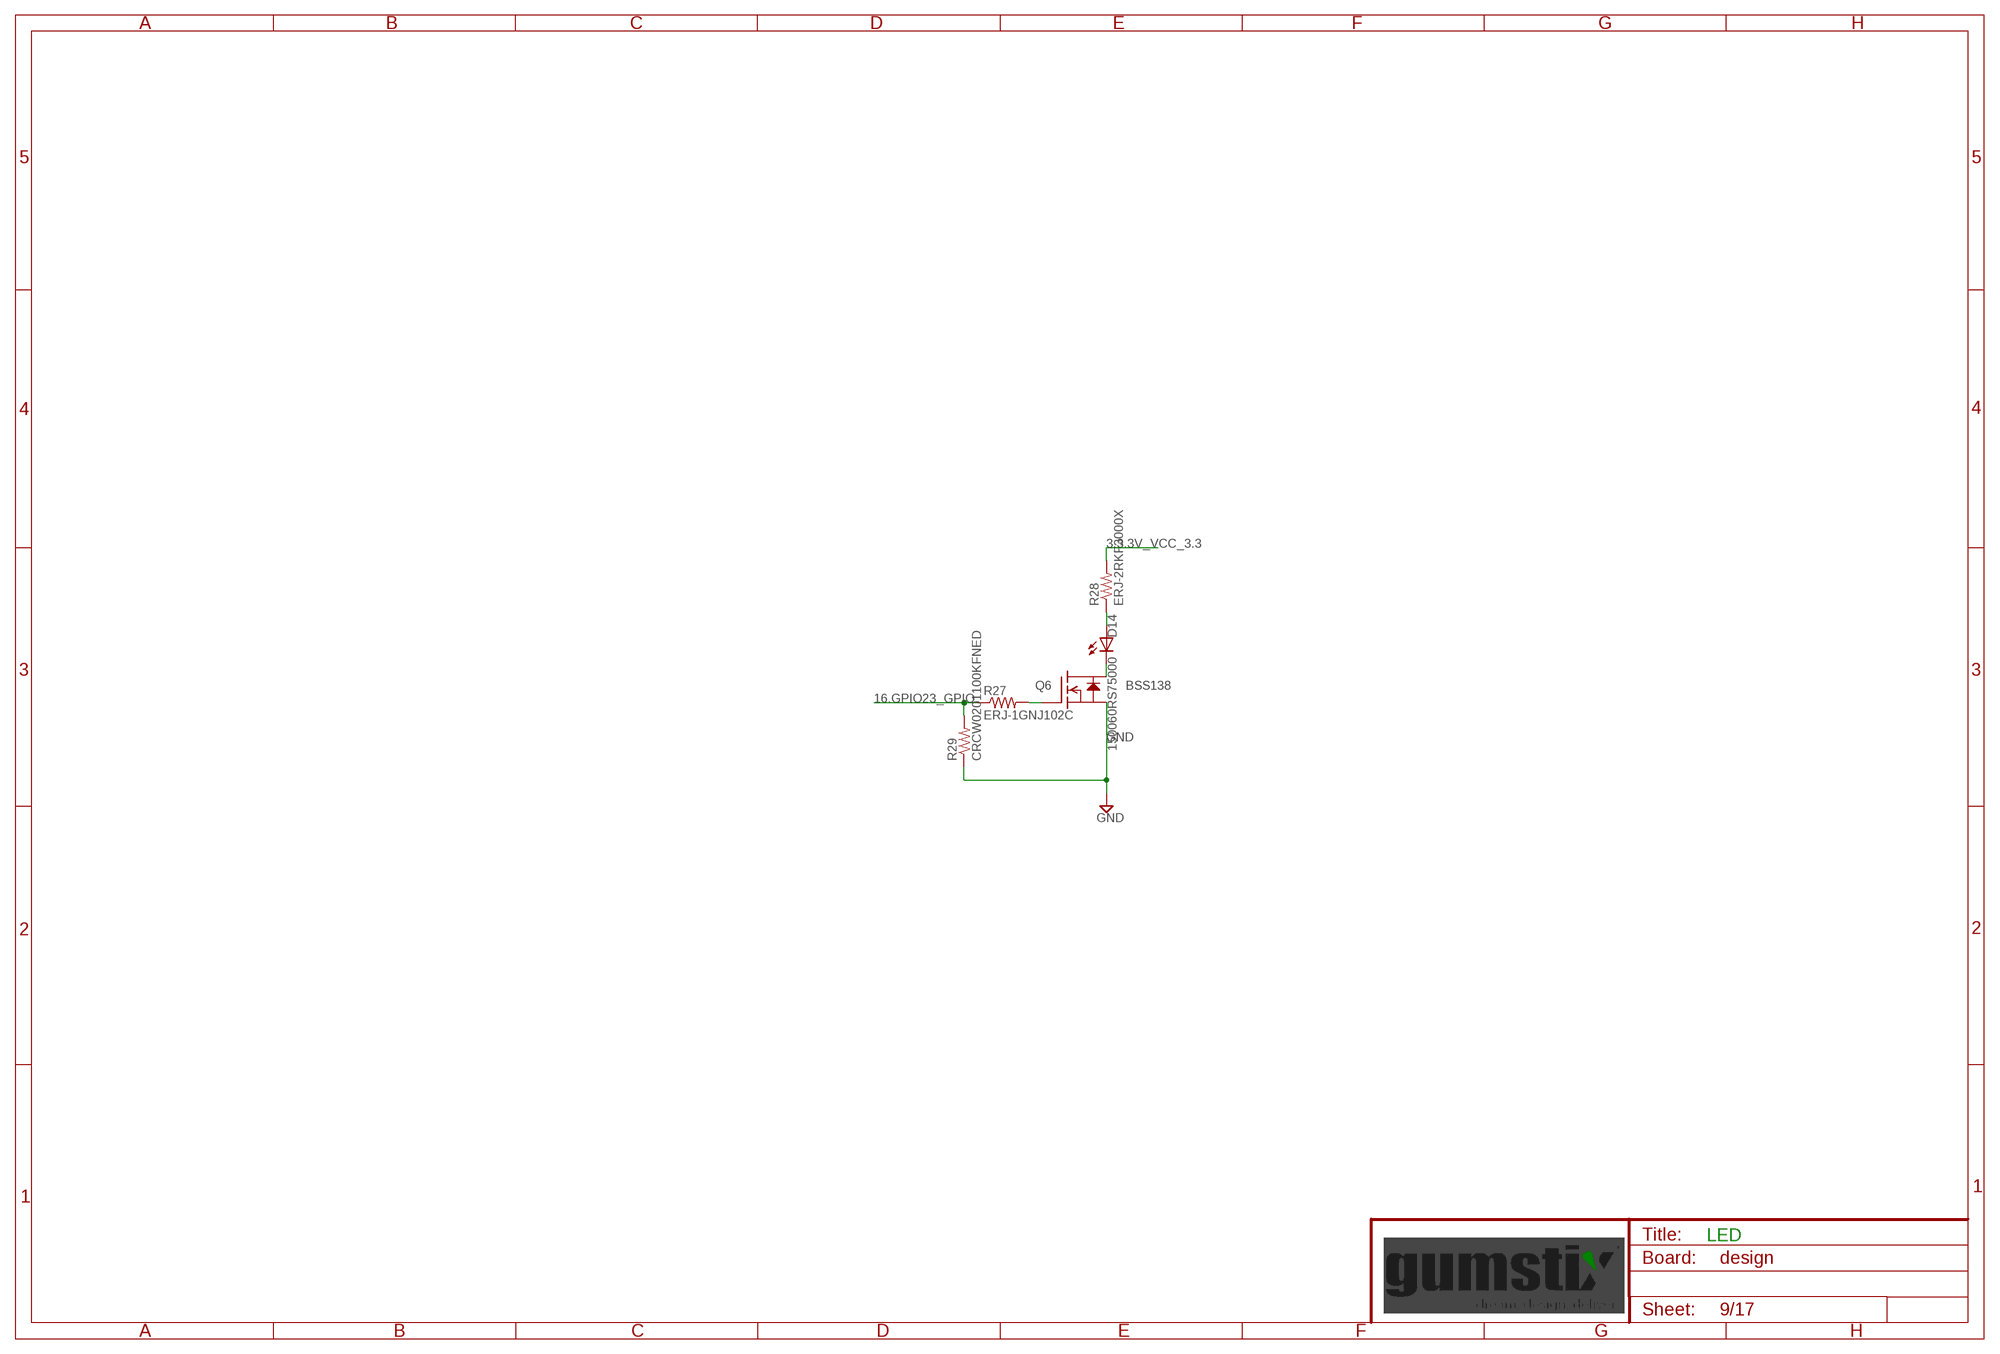
[diagram p8: schematic, sheet 9]

### Parts
D14  150060RS75000  [D0603]
Q6  BSS138  [SOT23]
R27  ERJ-1GNJ102C  [0201]
R28  ERJ-2RKF3000X  [0402]
R29  CRCW0201100KFNED  [0201]

### Nets
3.3.3V_VCC_3.3 [supply]: R28.2 ; also sheet 4,6,10,15
16.GPIO23_GPIO: R27.1 R29.2 ; also sheet 13,15
ANODE$12: D14.A R28.1
GATE$12: Q6.1(G) R27.2
GND [supply]: Q6.2(S) R29.1 ; also sheet 2,3,4,5,6,7,8,10,11,12,13,14,15,16,17
LED-$12: D14.C Q6.3(D)

### Notes on the sheet
- LED

## Sheet 10 of 17
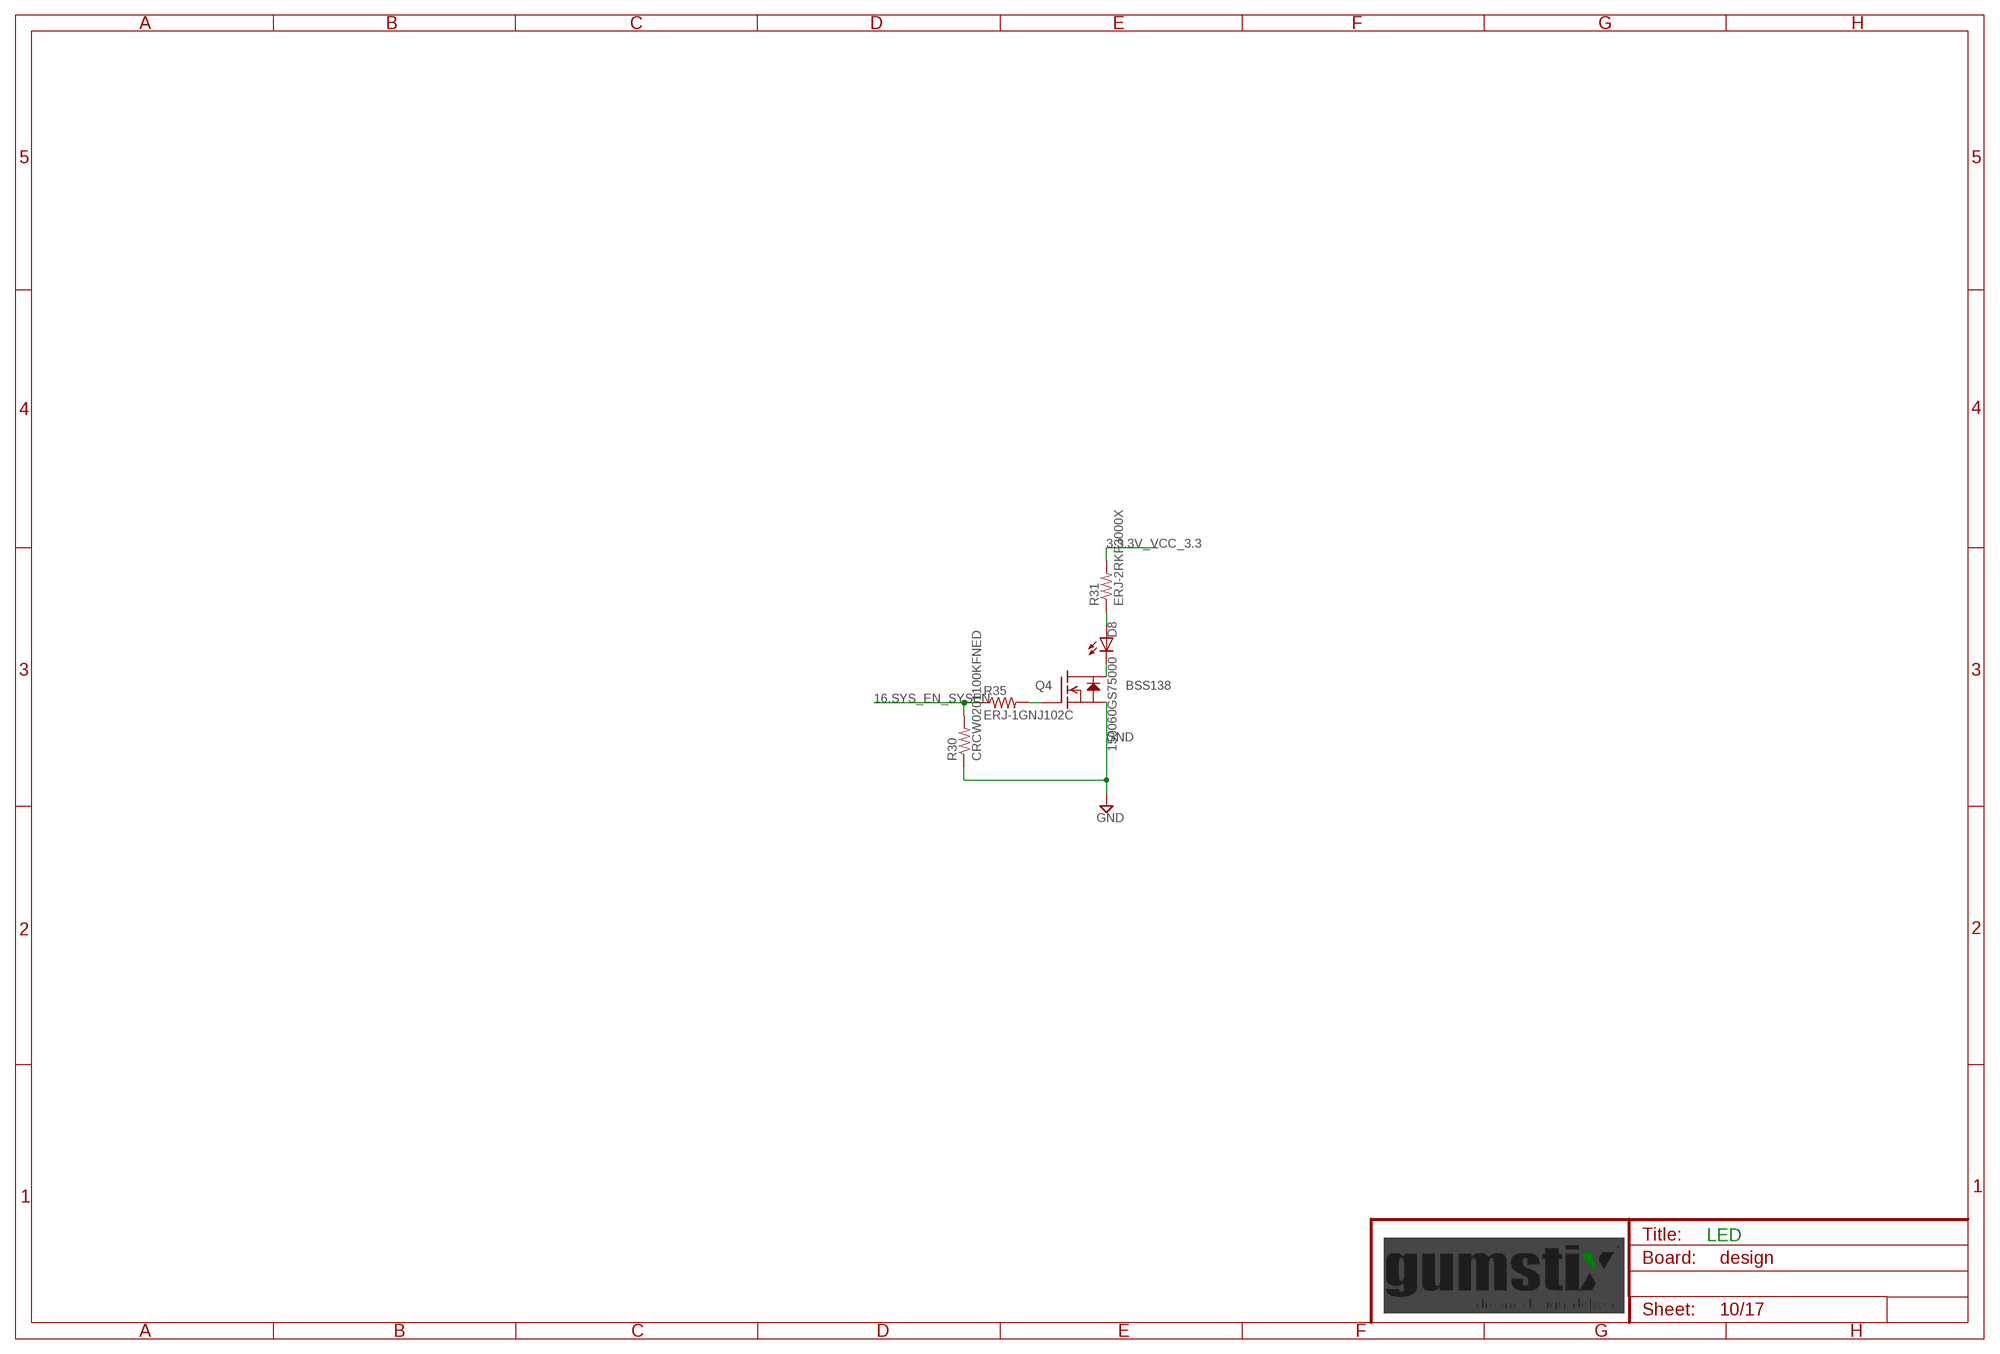
[diagram p9: schematic, sheet 10]

### Parts
D8  150060GS75000  [D0603]
Q4  BSS138  [SOT23]
R30  CRCW0201100KFNED  [0201]
R31  ERJ-2RKF3000X  [0402]
R35  ERJ-1GNJ102C  [0201]

### Nets
3.3.3V_VCC_3.3 [supply]: R31.2 ; also sheet 4,6,9,15
16.SYS_EN_SYSEN: R30.2 R35.1 ; also sheet 13
ANODE$13: D8.A R31.1
GATE$13: Q4.1(G) R35.2
GND [supply]: Q4.2(S) R30.1 ; also sheet 2,3,4,5,6,7,8,9,11,12,13,14,15,16,17
LED-$13: D8.C Q4.3(D)

### Notes on the sheet
- LED

## Sheet 11 of 17
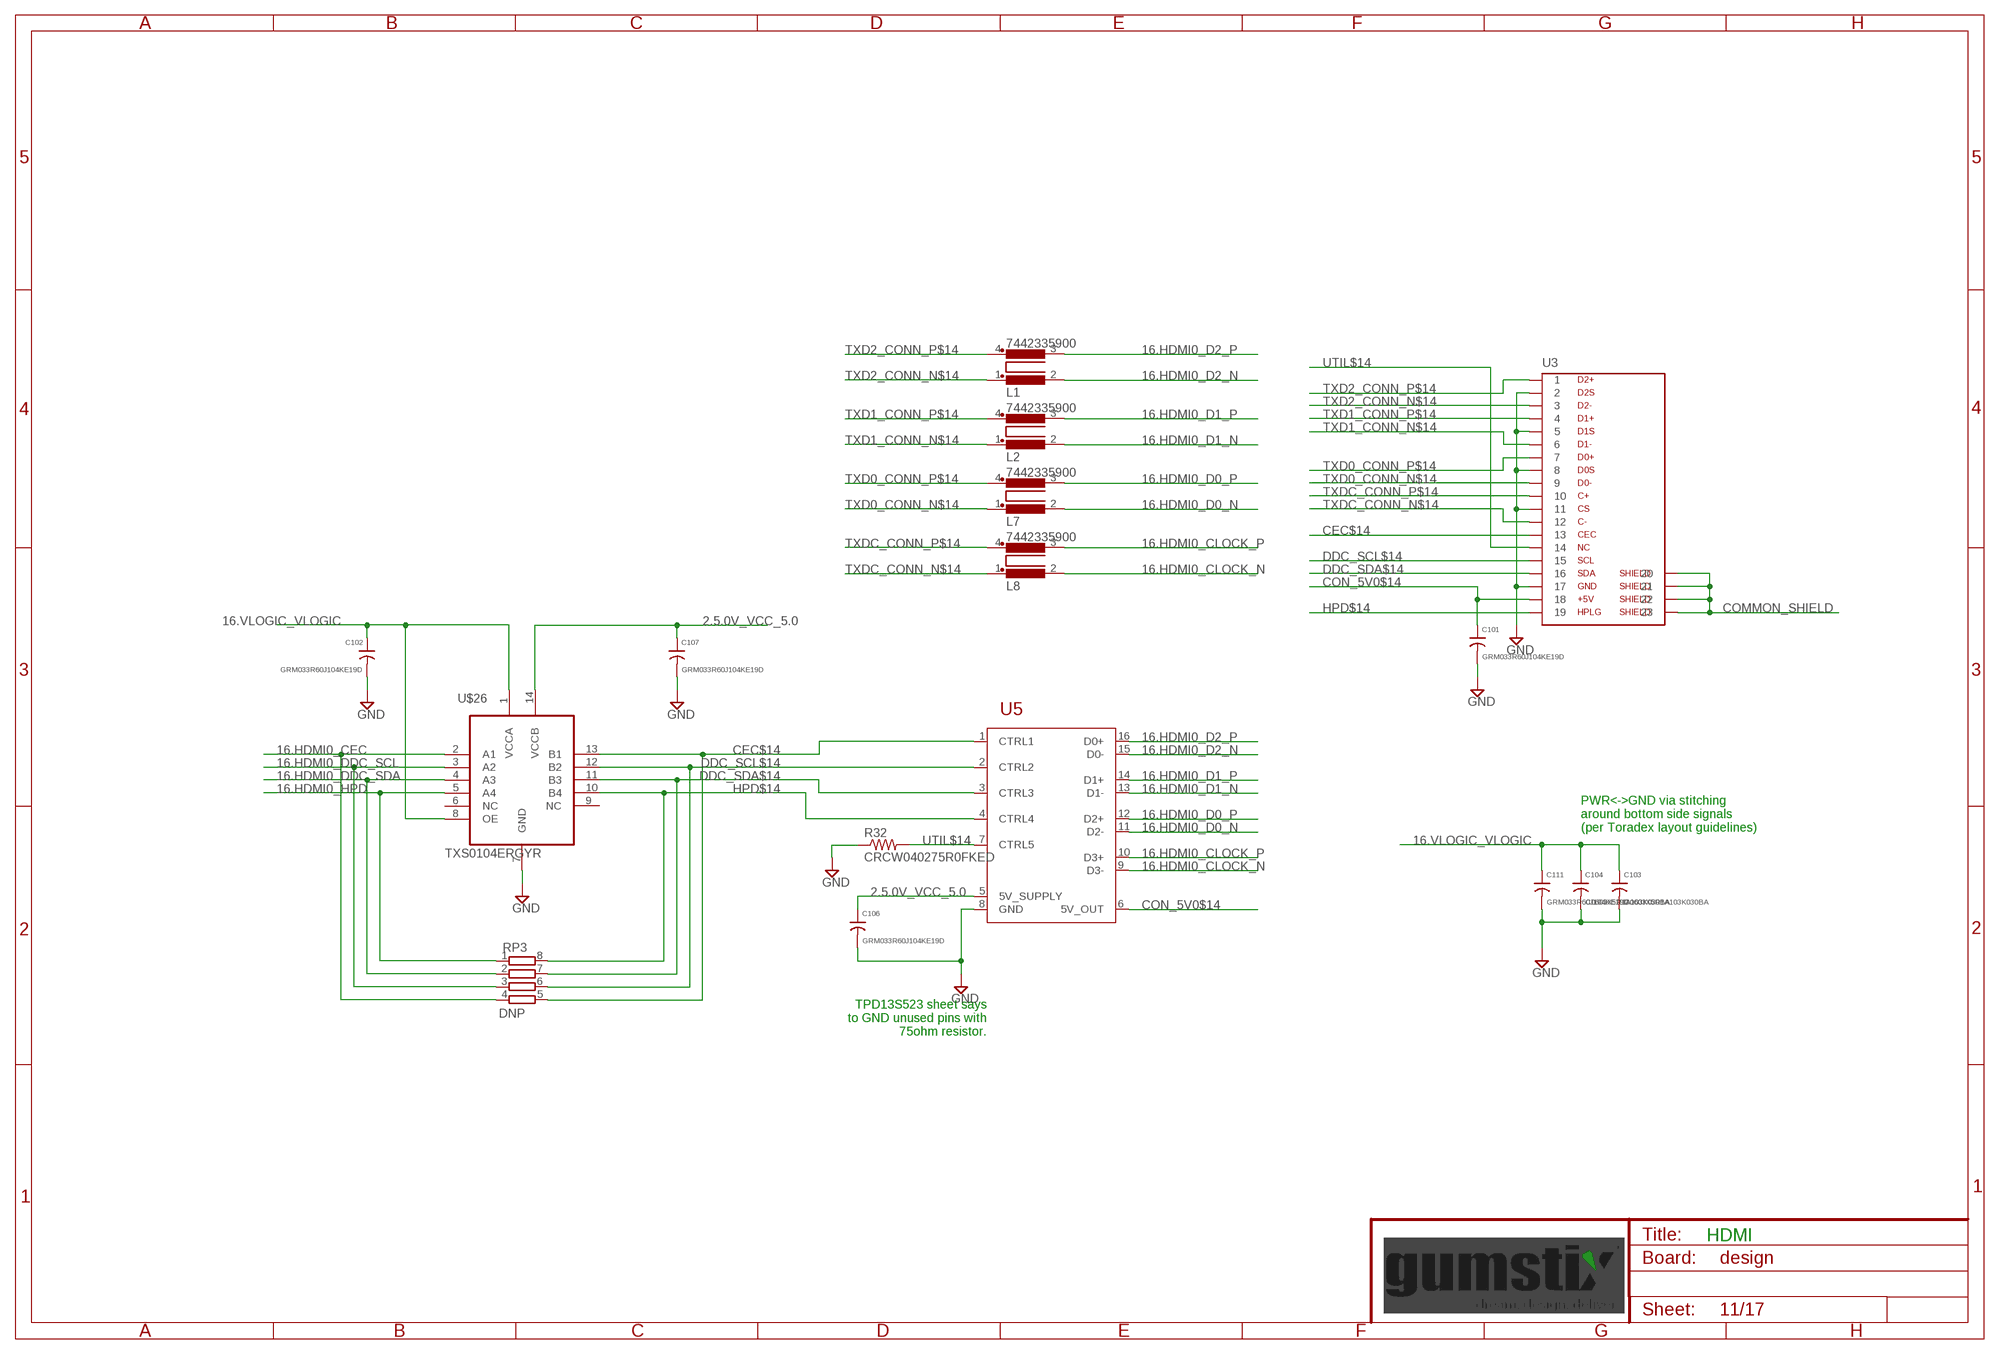
[diagram p10: schematic, sheet 11]

### Parts
C101  GRM033R60J104KE19D  [0201]
C102  GRM033R60J104KE19D  [0201]
C103  C0603X5R1A103K030BA  [0201]
C104  C0603X5R1A103K030BA  [0201]
C106  GRM033R60J104KE19D  [0201]
C107  GRM033R60J104KE19D  [0201]
C111  GRM033R60J104KE19D  [0201]
L1  7442335900  [0504-DLP11S]
L2  7442335900  [0504-DLP11S]
L7  7442335900  [0504-DLP11S]
L8  7442335900  [0504-DLP11S]
R32  CRCW040275R0FKED  [0402]
RP3  DNP  RP741X083741X08  [741X08]
U3  685119134923  [47151-001]
U5  TPD13S523PWR  [TSSOP16]
U$26  TXS0104ERGYR  [S-PVQFN-N14]

### Nets
2.5.0V_VCC_5.0 [supply]: C106.1 C107.1 U5.5(5V_SUPPLY) U$26.14(VCCB) ; also sheet 3,4,13,15,16,17
16.HDMI0_CEC: RP3.4 U$26.2(A1) ; also sheet 13
16.HDMI0_CLOCK_N [HDMI]: L8.2 U5.9(D3-) ; also sheet 13
16.HDMI0_CLOCK_P [HDMI]: L8.3 U5.10(D3+) ; also sheet 13
16.HDMI0_D0_N [HDMI]: L7.2 U5.11(D2-) ; also sheet 13
16.HDMI0_D0_P [HDMI]: L7.3 U5.12(D2+) ; also sheet 13
16.HDMI0_D1_N [HDMI]: L2.2 U5.13(D1-) ; also sheet 13
16.HDMI0_D1_P [HDMI]: L2.3 U5.14(D1+) ; also sheet 13
16.HDMI0_D2_N [HDMI]: L1.2 U5.15(D0-) ; also sheet 13
16.HDMI0_D2_P [HDMI]: L1.3 U5.16(D0+) ; also sheet 13
16.HDMI0_DDC_SCL: RP3.3 U$26.3(A2) ; also sheet 13
16.HDMI0_DDC_SDA: RP3.2 U$26.4(A3) ; also sheet 13
16.HDMI0_HPD: RP3.1 U$26.5(A4) ; also sheet 13
16.VLOGIC_VLOGIC [supply]: C102.1 C103.1 C104.1 C111.1 U$26.1(VCCA) U$26.8(OE) ; also sheet 7,8,12,13
CEC$14: RP3.5 U3.13 U5.1(CTRL1) U$26.13(B1)
COMMON_SHIELD [supply]: U3.G1 U3.G2 U3.G3 U3.G4 ; also sheet 5,16
CON_5V0$14 [supply]: C101.1 U3.18 U5.6(5V_OUT)
DDC_SCL$14: RP3.6 U3.15 U5.2(CTRL2) U$26.12(B2)
DDC_SDA$14: RP3.7 U3.16 U5.3(CTRL3) U$26.11(B3)
GND [supply]: C101.2 C102.2 C103.2 C104.2 C106.2 C107.2 C111.2 R32.1 U3.2 U3.5 U3.8 U3.11 U3.17 U5.8(GND) U$26.7(GND) ; also sheet 2,3,4,5,6,7,8,9,10,12,13,14,15,16,17
HPD$14: RP3.8 U3.19 U5.4(CTRL4) U$26.10(B4)
TXD0_CONN_N$14 [HDMI]: L7.1 U3.9
TXD0_CONN_P$14 [HDMI]: L7.4 U3.7
TXD1_CONN_N$14 [HDMI]: L2.1 U3.6
TXD1_CONN_P$14 [HDMI]: L2.4 U3.4
TXD2_CONN_N$14 [HDMI]: L1.1 U3.3
TXD2_CONN_P$14 [HDMI]: L1.4 U3.1
TXDC_CONN_N$14 [HDMI]: L8.1 U3.12
TXDC_CONN_P$14 [HDMI]: L8.4 U3.10
UTIL$14: R32.2 U3.14 U5.7(CTRL5)
Unconnected: U$26.6(NC) U$26.9(NC)

### Notes on the sheet
- PWR<->GND via stitching
  around bottom side signals
  (per Toradex layout guidelines)
- TPD13S523 sheet says
  to GND unused pins with
  75ohm resistor.
- HDMI

## Sheet 12 of 17
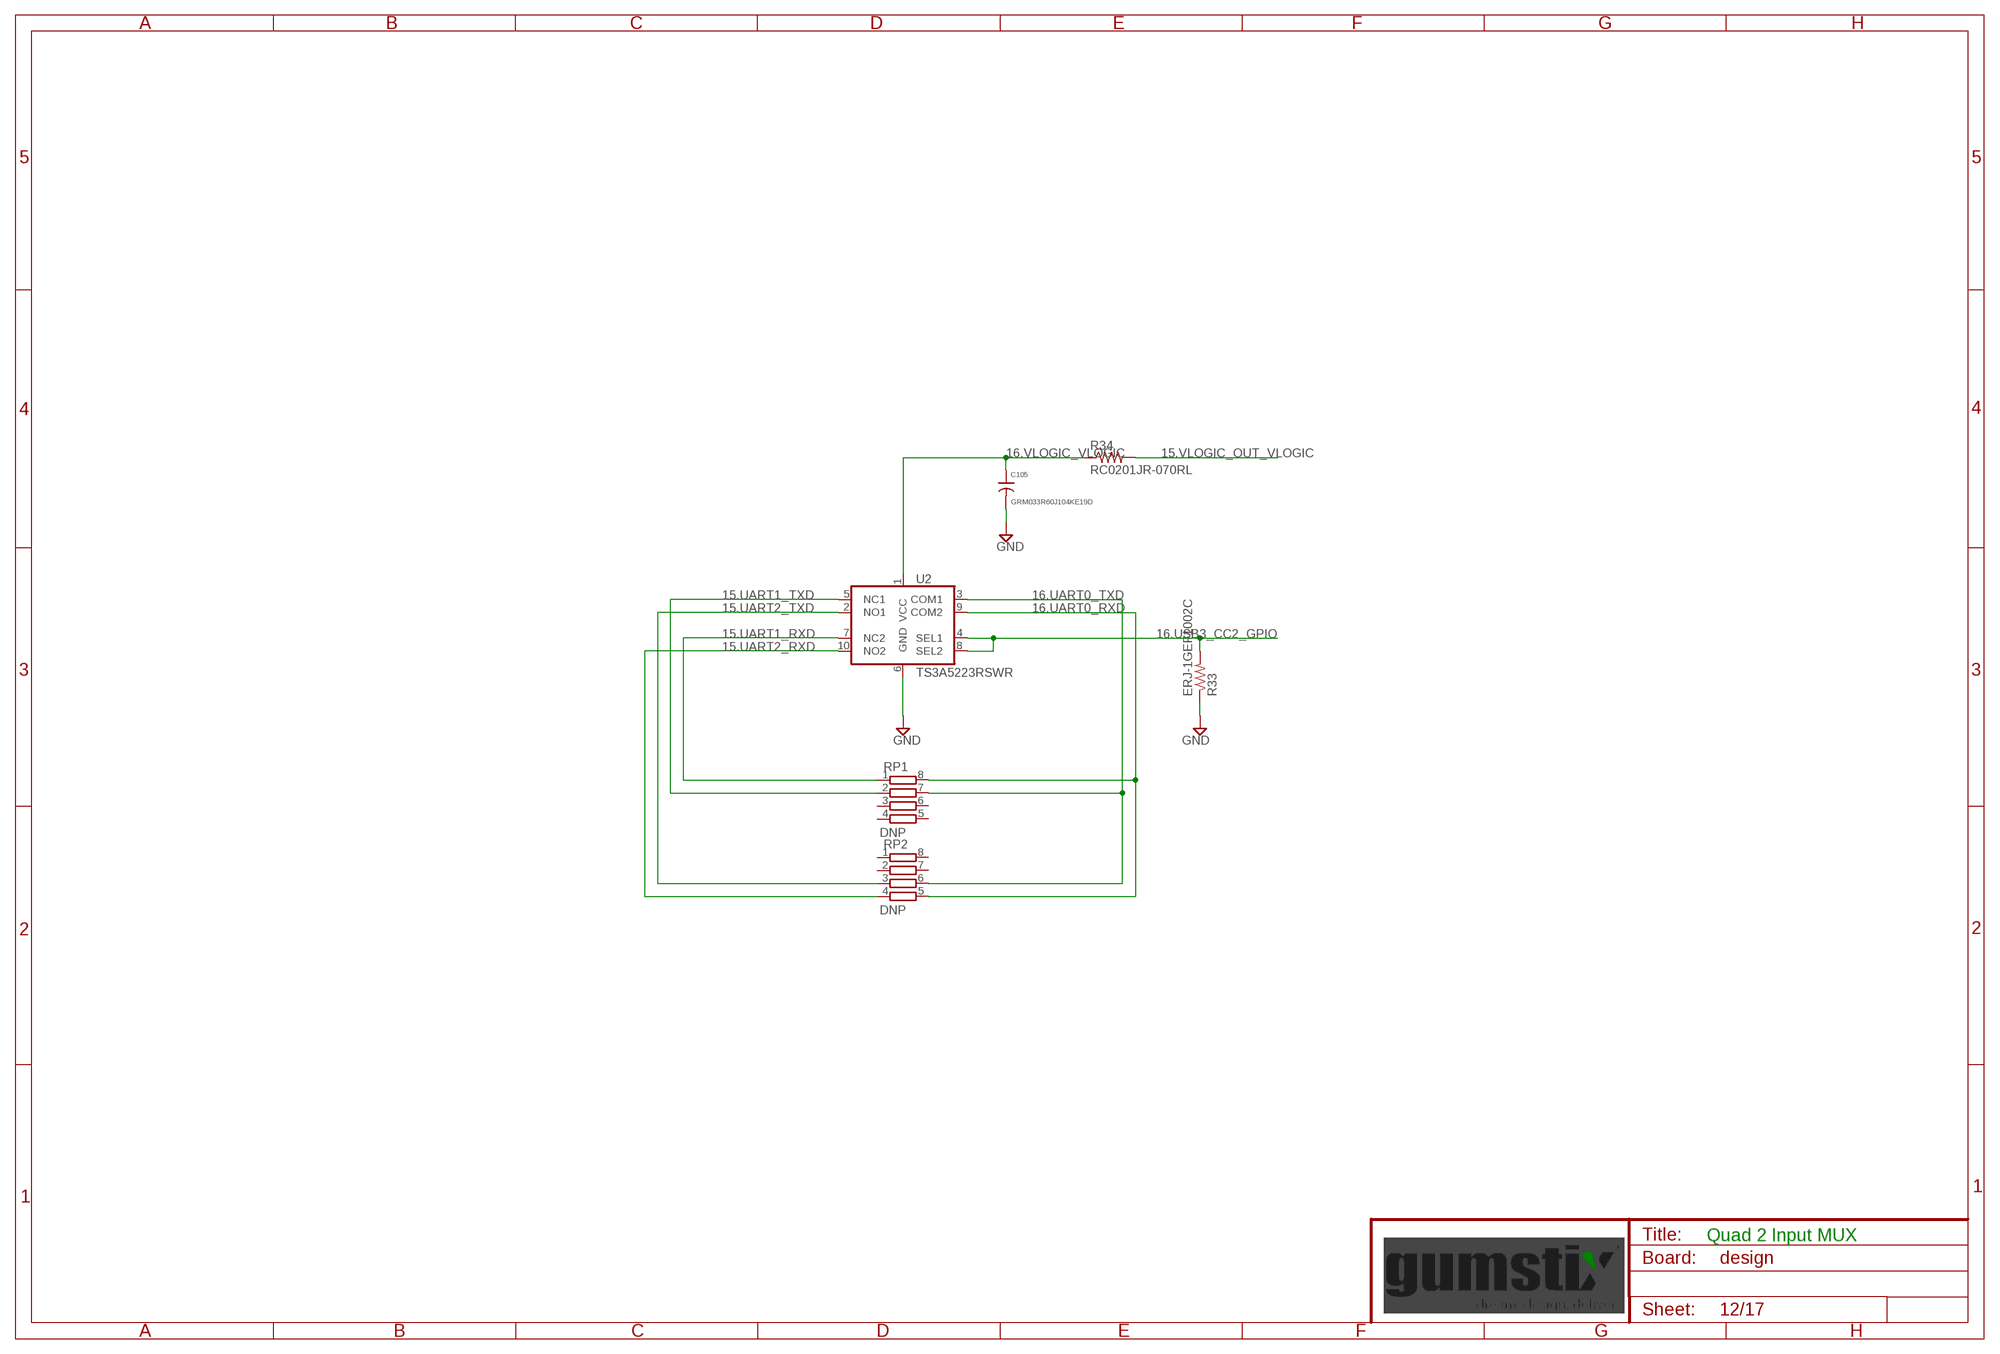
[diagram p11: schematic, sheet 12]

### Parts
C105  GRM033R60J104KE19D  [0201]
R33  ERJ-1GEF1002C  [0201]
R34  RC0201JR-070RL  [0201]
RP1  DNP  RP741X083  [RP741X083]
RP2  DNP  RP741X083  [RP741X083]
U2  TS3A5223RSWR  [UQFN-10]

### Nets
15.UART1_RXD: RP1.1 U2.7(NC2) ; also sheet 15
15.UART1_TXD: RP1.2 U2.5(NC1) ; also sheet 15
15.UART2_RXD: RP2.4 U2.10(NO2) ; also sheet 2
15.UART2_TXD: RP2.3 U2.2(NO1) ; also sheet 2
15.VLOGIC_OUT_VLOGIC [supply]: R34.2 ; also sheet 2
16.UART0_RXD: RP1.8 RP2.5 U2.9(COM2) ; also sheet 13
16.UART0_TXD: RP1.7 RP2.6 U2.3(COM1) ; also sheet 13
16.USB3_CC2_GPIO: R33.2 U2.4(SEL1) U2.8(SEL2) ; also sheet 13
16.VLOGIC_VLOGIC [supply]: C105.1 R34.1 U2.1(VCC) ; also sheet 7,8,11,13
GND [supply]: C105.2 R33.1 U2.6(GND) ; also sheet 2,3,4,5,6,7,8,9,10,11,13,14,15,16,17
Unconnected: RP1.3 RP1.4 RP1.5 RP1.6 RP2.1 RP2.2 RP2.7 RP2.8

### Notes on the sheet
- Quad 2 Input MUX

## Sheet 13 of 17
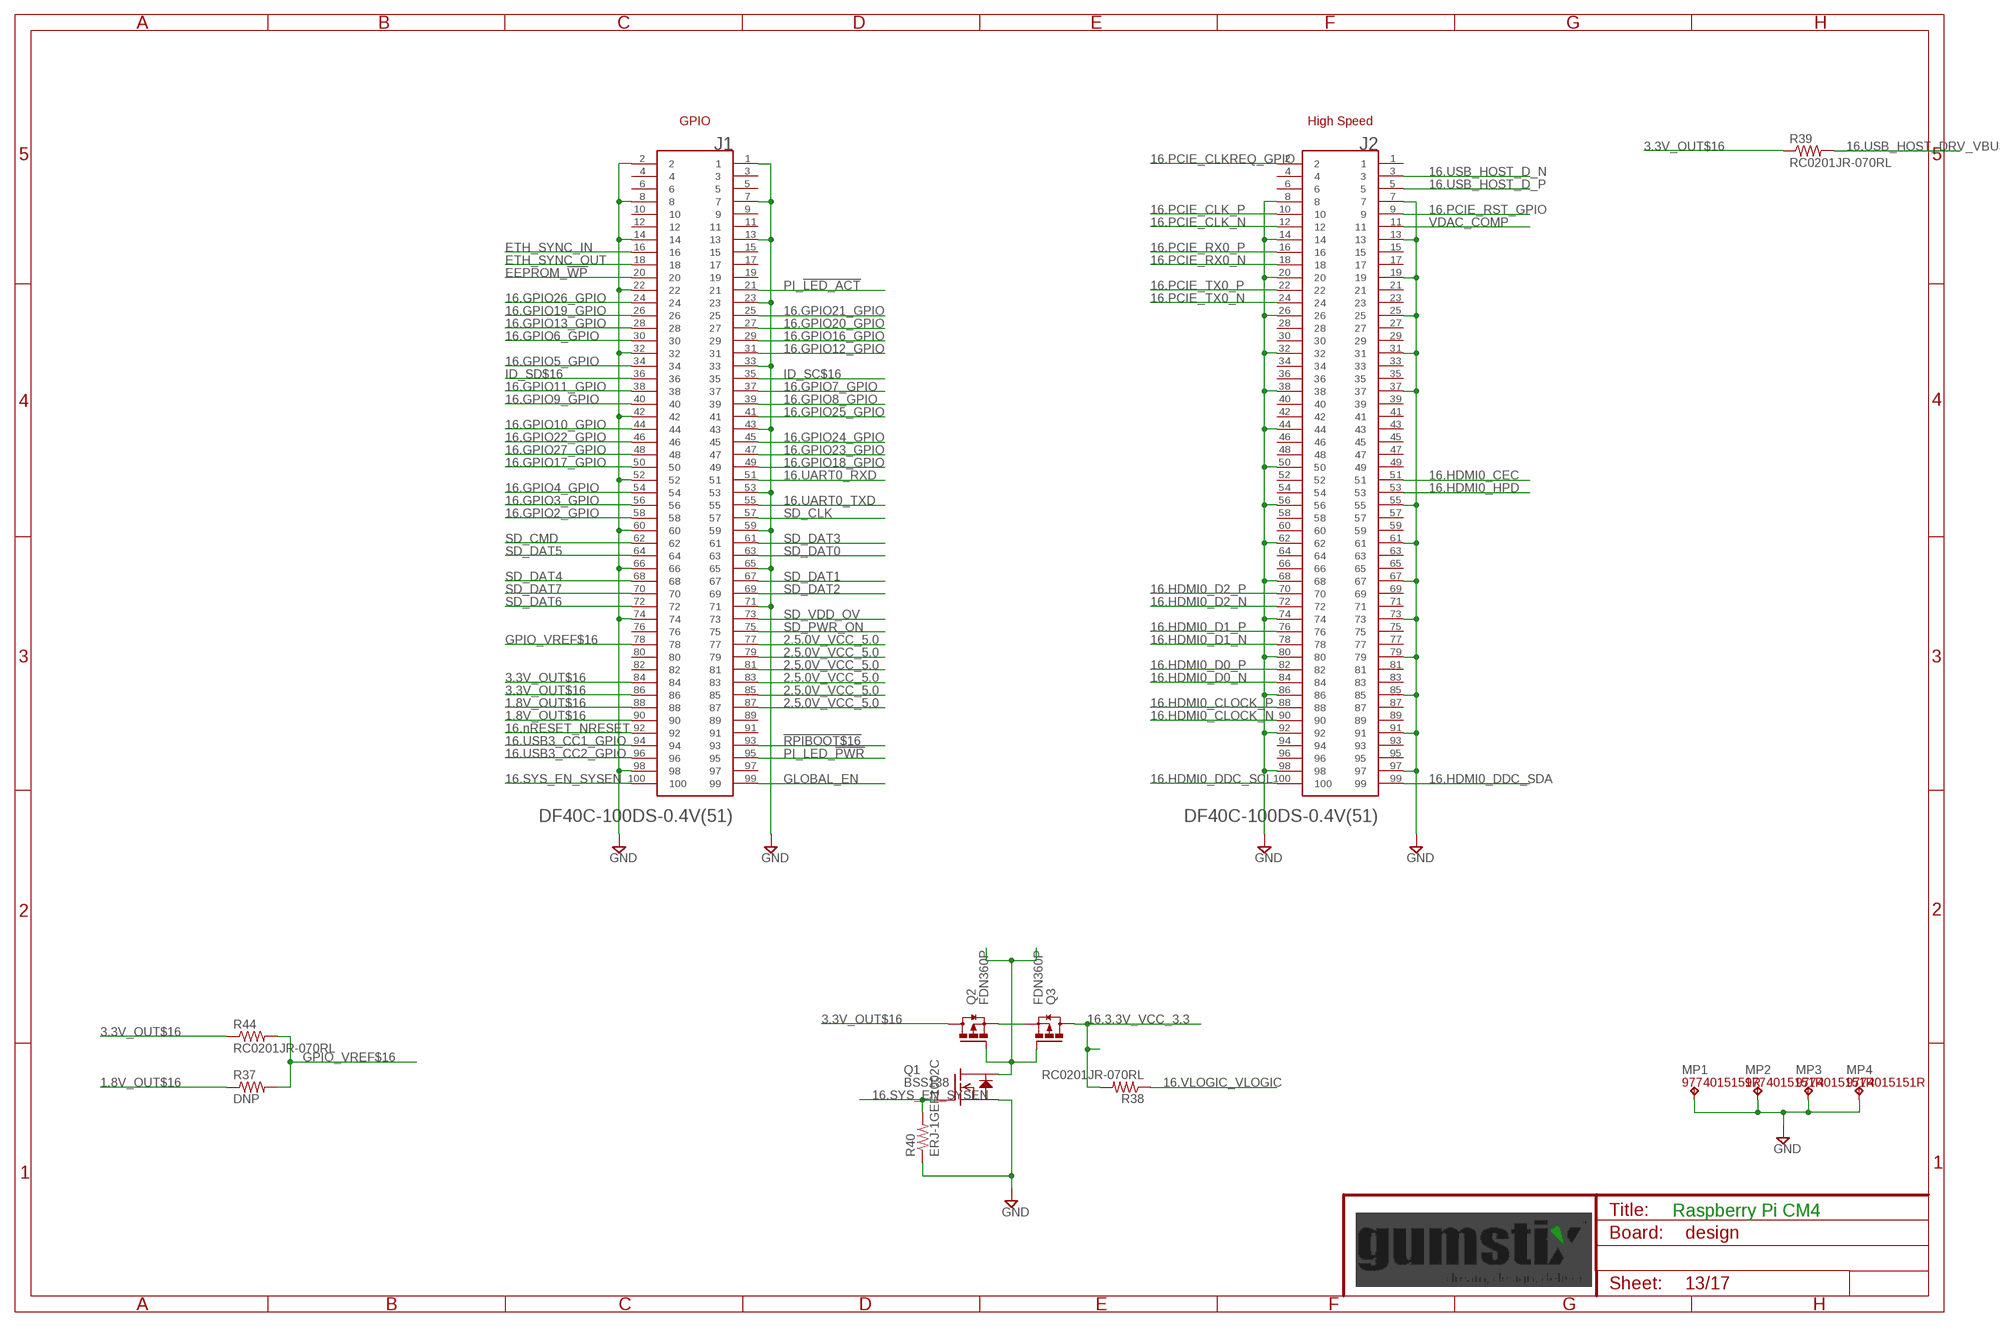
[diagram p12: schematic, sheet 13]

### Parts
J1  DF40C-100DS-0.4V(51)  [HRS_DF40C-100DS-0.4V(51)]
J2  DF40C-100DS-0.4V(51)  [HRS_DF40C-100DS-0.4V(51)]
MP1  9774015151R  [WA-SMSI_9774___151]
MP2  9774015151R  [WA-SMSI_9774___151]
MP3  9774015151R  [WA-SMSI_9774___151]
MP4  9774015151R  [WA-SMSI_9774___151]
Q1  BSS138  [SOT23]
Q2  FDN360P  [SOT23]
Q3  FDN360P  [SOT23]
R37  DNP  R0201  [0201]
R38  RC0201JR-070RL  [0201]
R39  RC0201JR-070RL  [0201]
R40  ERJ-1GEF1002C  [0201]
R44  RC0201JR-070RL  [0201]

### Nets
1.8V_OUT$16 [supply]: J1.88 J1.90 R37.1
2.5.0V_VCC_5.0 [supply]: J1.77 J1.79 J1.81 J1.83 J1.85 J1.87 ; also sheet 3,4,11,15,16,17
3.3V_OUT$16 [supply]: J1.84 J1.86 Q2.3(D) R39.1 R44.1
16.3.3V_VCC_3.3 [supply]: Q3.3(D) R38.2 ; also sheet 15,17
16.GPIO2_GPIO: J1.58 ; also sheet 15
16.GPIO3_GPIO: J1.56 ; also sheet 15
16.GPIO4_GPIO: J1.54 ; also sheet 15
16.GPIO5_GPIO: J1.34 ; also sheet 15
16.GPIO6_GPIO: J1.30 ; also sheet 15
16.GPIO7_GPIO: J1.37 ; also sheet 15
16.GPIO8_GPIO: J1.39 ; also sheet 15
16.GPIO9_GPIO: J1.40 ; also sheet 15
16.GPIO10_GPIO: J1.44 ; also sheet 15
16.GPIO11_GPIO: J1.38 ; also sheet 15
16.GPIO12_GPIO: J1.31 ; also sheet 15
16.GPIO13_GPIO: J1.28 ; also sheet 15
16.GPIO16_GPIO: J1.29 ; also sheet 15
16.GPIO17_GPIO: J1.50 ; also sheet 15
16.GPIO18_GPIO: J1.49 ; also sheet 15
16.GPIO19_GPIO: J1.26 ; also sheet 15
16.GPIO20_GPIO: J1.27 ; also sheet 15
16.GPIO21_GPIO: J1.25 ; also sheet 15
16.GPIO22_GPIO: J1.46 ; also sheet 15
16.GPIO23_GPIO: J1.47 ; also sheet 9,15
16.GPIO24_GPIO: J1.45 ; also sheet 15
16.GPIO25_GPIO: J1.41 ; also sheet 15
16.GPIO26_GPIO: J1.24 ; also sheet 15
16.GPIO27_GPIO: J1.48 ; also sheet 15
16.HDMI0_CEC: J2.51 ; also sheet 11
16.HDMI0_CLOCK_N [HDMI]: J2.90 ; also sheet 11
16.HDMI0_CLOCK_P [HDMI]: J2.88 ; also sheet 11
16.HDMI0_D0_N [HDMI]: J2.84 ; also sheet 11
16.HDMI0_D0_P [HDMI]: J2.82 ; also sheet 11
16.HDMI0_D1_N [HDMI]: J2.78 ; also sheet 11
16.HDMI0_D1_P [HDMI]: J2.76 ; also sheet 11
16.HDMI0_D2_N [HDMI]: J2.72 ; also sheet 11
16.HDMI0_D2_P [HDMI]: J2.70 ; also sheet 11
16.HDMI0_DDC_SCL: J2.100 ; also sheet 11
16.HDMI0_DDC_SDA: J2.99 ; also sheet 11
16.HDMI0_HPD: J2.53 ; also sheet 11
16.nRESET_NRESET: J1.92 ; also sheet 7
16.PCIE_CLK_N [USB]: J2.12 ; also sheet 6
16.PCIE_CLK_P [USB]: J2.10 ; also sheet 6
16.PCIE_CLKREQ_GPIO: J2.2 ; also sheet 6
16.PCIE_RST_GPIO: J2.9 ; also sheet 6
16.PCIE_RX0_N [USB]: J2.18 ; also sheet 6
16.PCIE_RX0_P [USB]: J2.16 ; also sheet 6
16.PCIE_TX0_N [USB]: J2.24 ; also sheet 6
16.PCIE_TX0_P [USB]: J2.22 ; also sheet 6
16.SYS_EN_SYSEN: J1.100 Q1.1(G) R40.2 ; also sheet 10
16.UART0_RXD: J1.51 ; also sheet 12
16.UART0_TXD: J1.55 ; also sheet 12
16.USB3_CC1_GPIO: J1.94 ; also sheet 8
16.USB3_CC2_GPIO: J1.96 ; also sheet 12
16.USB_HOST_D_N [USB]: J2.3 ; also sheet 17
16.USB_HOST_D_P [USB]: J2.5 ; also sheet 17
16.USB_HOST_DRV_VBUS: R39.2 ; also sheet 17
16.VLOGIC_VLOGIC [supply]: R38.1 ; also sheet 7,8,11,12
!RPIBOOT$16: J1.93 ; also sheet 14
DS_LOAD$16 [supply]: Q2.2(S) Q3.2(S)
EEPROM_!WP: J1.20
ETH_SYNC_IN: J1.16
ETH_SYNC_OUT: J1.18
GLOBAL_EN: J1.99
GND [supply]: J1.1 J1.2 J1.7 J1.8 J1.13 J1.14 J1.22 J1.23 J1.32 J1.33 J1.42 J1.43 J1.52 J1.53 J1.59 J1.60 J1.65 J1.66 J1.71 J1.74 J1.98 J2.7 J2.8 J2.13 J2.14 J2.19 J2.20 J2.25 J2.26 J2.31 J2.32 J2.37 J2.38 J2.44 J2.50 J2.55 J2.56 J2.61 J2.62 J2.67 J2.68 J2.73 J2.74 J2.79 J2.80 J2.85 J2.86 J2.91 J2.92 J2.97 J2.98 MP1.1(TP) MP2.1(TP) MP3.1(TP) MP4.1(TP) Q1.2(S) R40.1 ; also sheet 2,3,4,5,6,7,8,9,10,11,12,14,15,16,17
GPIO_VREF$16 [supply]: J1.78 R37.2 R44.2 ; also sheet 14
ID_SC$16: J1.35 ; also sheet 14
ID_SD$16: J1.36 ; also sheet 14
LOAD_GATE$16: Q1.3(D) Q2.1(G) Q3.1(G)
PI_!LED_ACT: J1.21
PI_LED_!PWR: J1.95
SD_CLK: J1.57
SD_CMD: J1.62
SD_DAT0: J1.63
SD_DAT1: J1.67
SD_DAT2: J1.69
SD_DAT3: J1.61
SD_DAT4: J1.68
SD_DAT5: J1.64
SD_DAT6: J1.72
SD_DAT7: J1.70
SD_PWR_ON: J1.75
SD_VDD_OV: J1.73
VDAC_COMP: J2.11
Unconnected: J1.3 J1.4 J1.5 J1.6 J1.9 J1.10 J1.11 J1.12 J1.15 J1.17 J1.19 J1.76 J1.80 J1.82 J1.89 J1.91 J1.97 J2.1 J2.4 J2.6 J2.15 J2.17 J2.21 J2.23 J2.27 J2.28 J2.29 J2.30 J2.33 J2.34 J2.35 J2.36 J2.39 J2.40 J2.41 J2.42 J2.43 J2.45 J2.46 J2.47 J2.48 J2.49 J2.52 J2.54 J2.57 J2.58 J2.59 J2.60 J2.63 J2.64 J2.65 J2.66 J2.69 J2.71 J2.75 J2.77 J2.81 J2.83 J2.87 J2.89 J2.93 J2.94 J2.95 J2.96

### Notes on the sheet
- GPIO | High Speed
- Raspberry Pi CM4

## Sheet 14 of 17
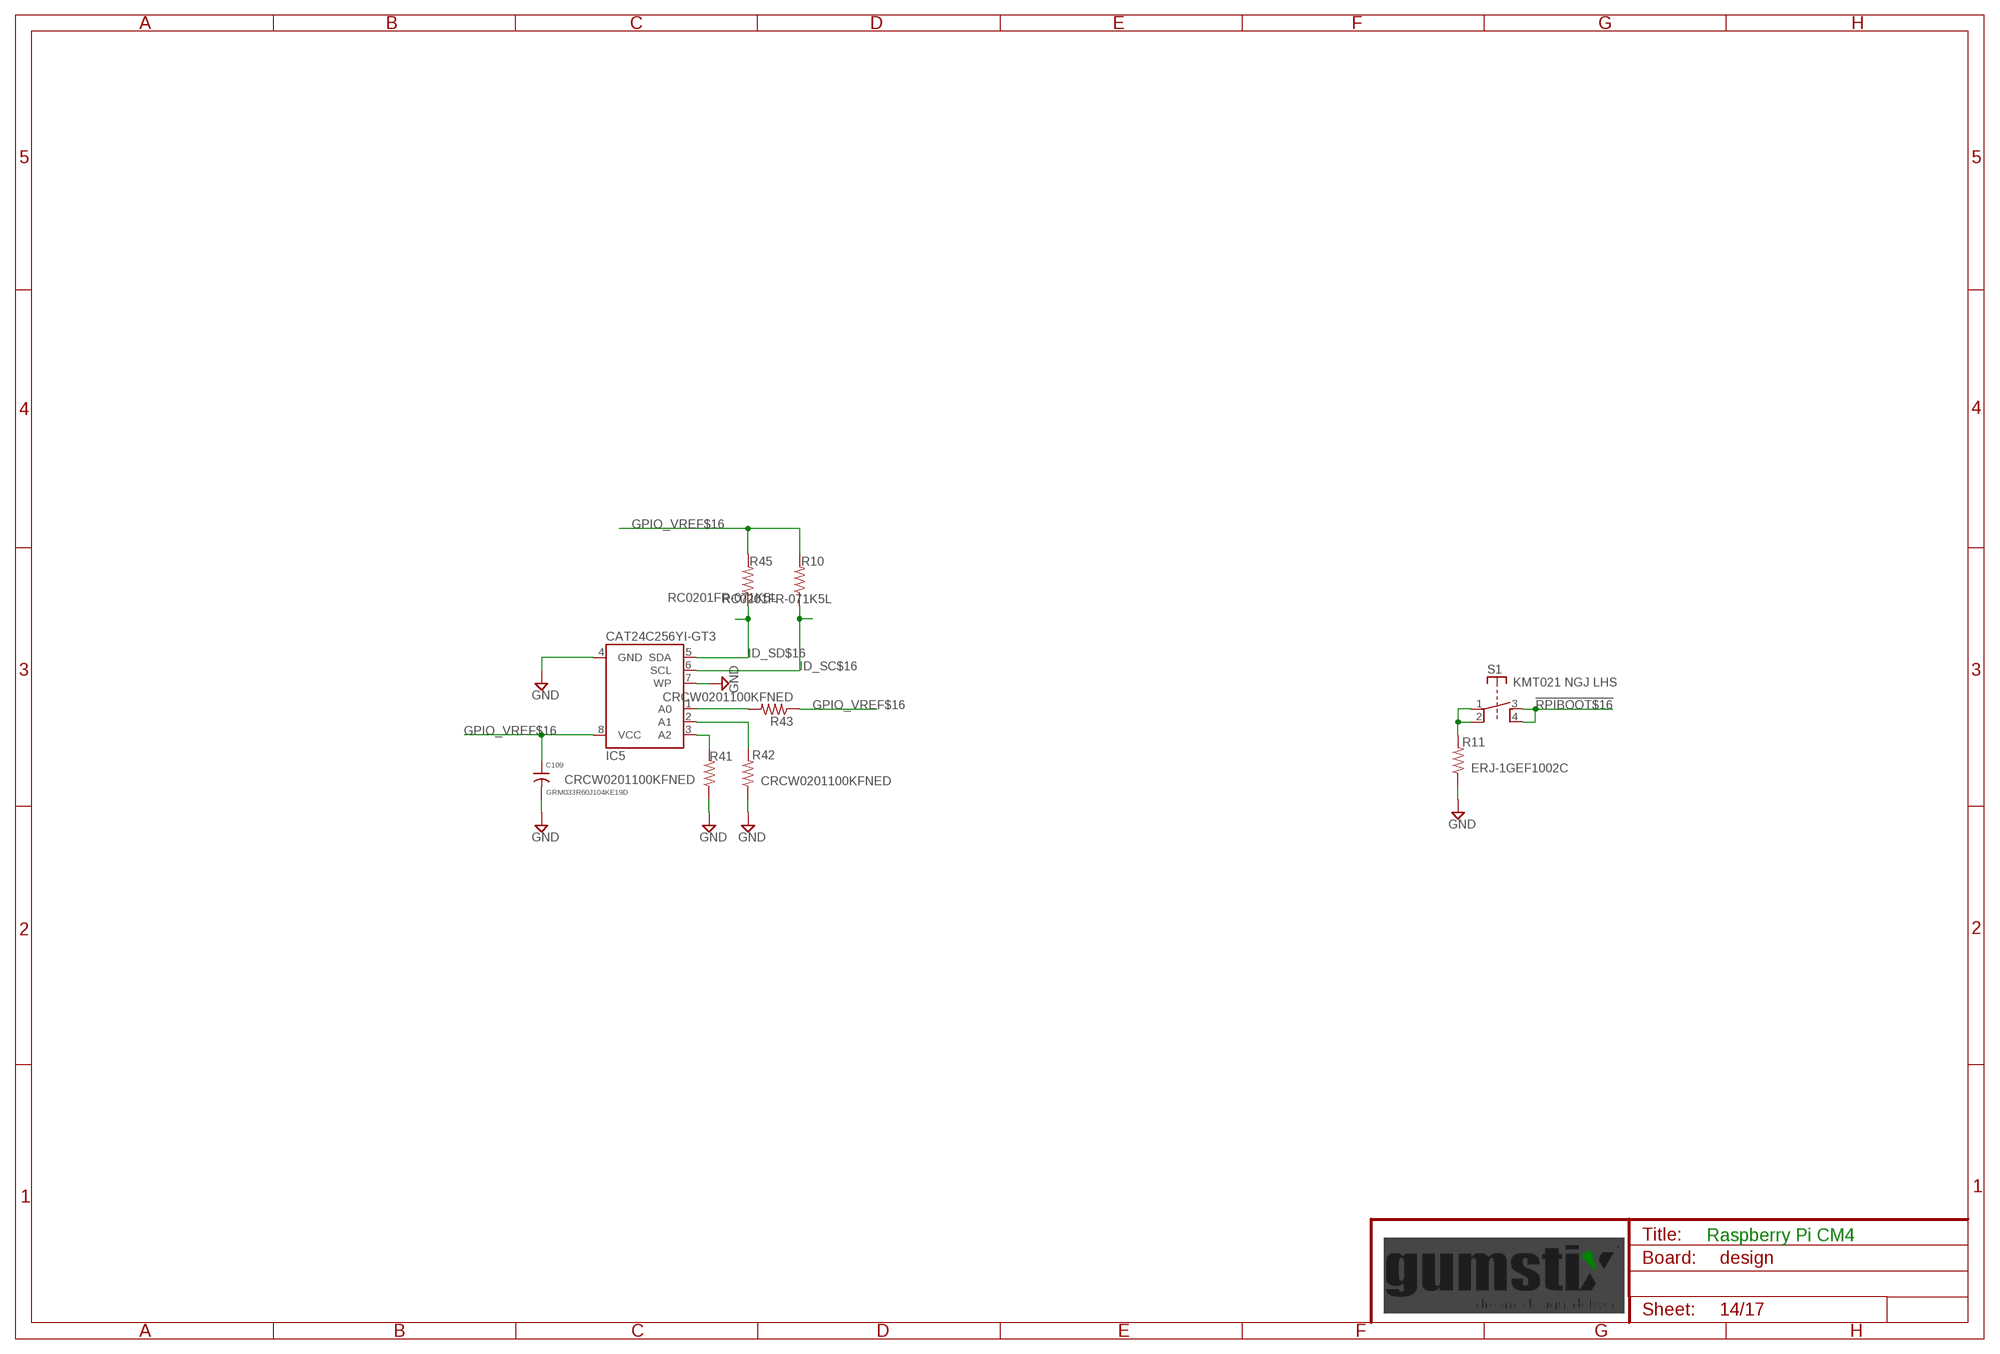
[diagram p13: schematic, sheet 14]

### Parts
C109  GRM033R60J104KE19D  [0201]
IC5  CAT24C256YI-GT3  [TSSOP8]
R10  RC0201FR-071K5L  [0201]
R11  ERJ-1GEF1002C  [0201]
R41  CRCW0201100KFNED  [0201]
R42  CRCW0201100KFNED  [0201]
R43  CRCW0201100KFNED  [0201]
R45  RC0201FR-071K5L  [0201]
S1  KMT021 NGJ LHS  KMT021-NGJ-LHS  [KMT0]

### Nets
!RPIBOOT$16: S1.3(B) S1.4(B') ; also sheet 13
A0$16: IC5.1(A0) R43.2
A1$16: IC5.2(A1) R42.2
A2$16: IC5.3(A2) R41.2
GND [supply]: C109.2 IC5.4(GND) IC5.7(WP) R11.1 R41.1 R42.1 ; also sheet 2,3,4,5,6,7,8,9,10,11,12,13,15,16,17
GPIO_VREF$16 [supply]: C109.1 IC5.8(VCC) R10.2 R43.1 R45.2 ; also sheet 13
ID_SC$16: IC5.6(SCL) R10.1 ; also sheet 13
ID_SD$16: IC5.5(SDA) R45.1 ; also sheet 13
RPIBOOT_SWITCH$16: R11.2 S1.1(A) S1.2(A')

### Notes on the sheet
- Raspberry Pi CM4

## Sheet 15 of 17
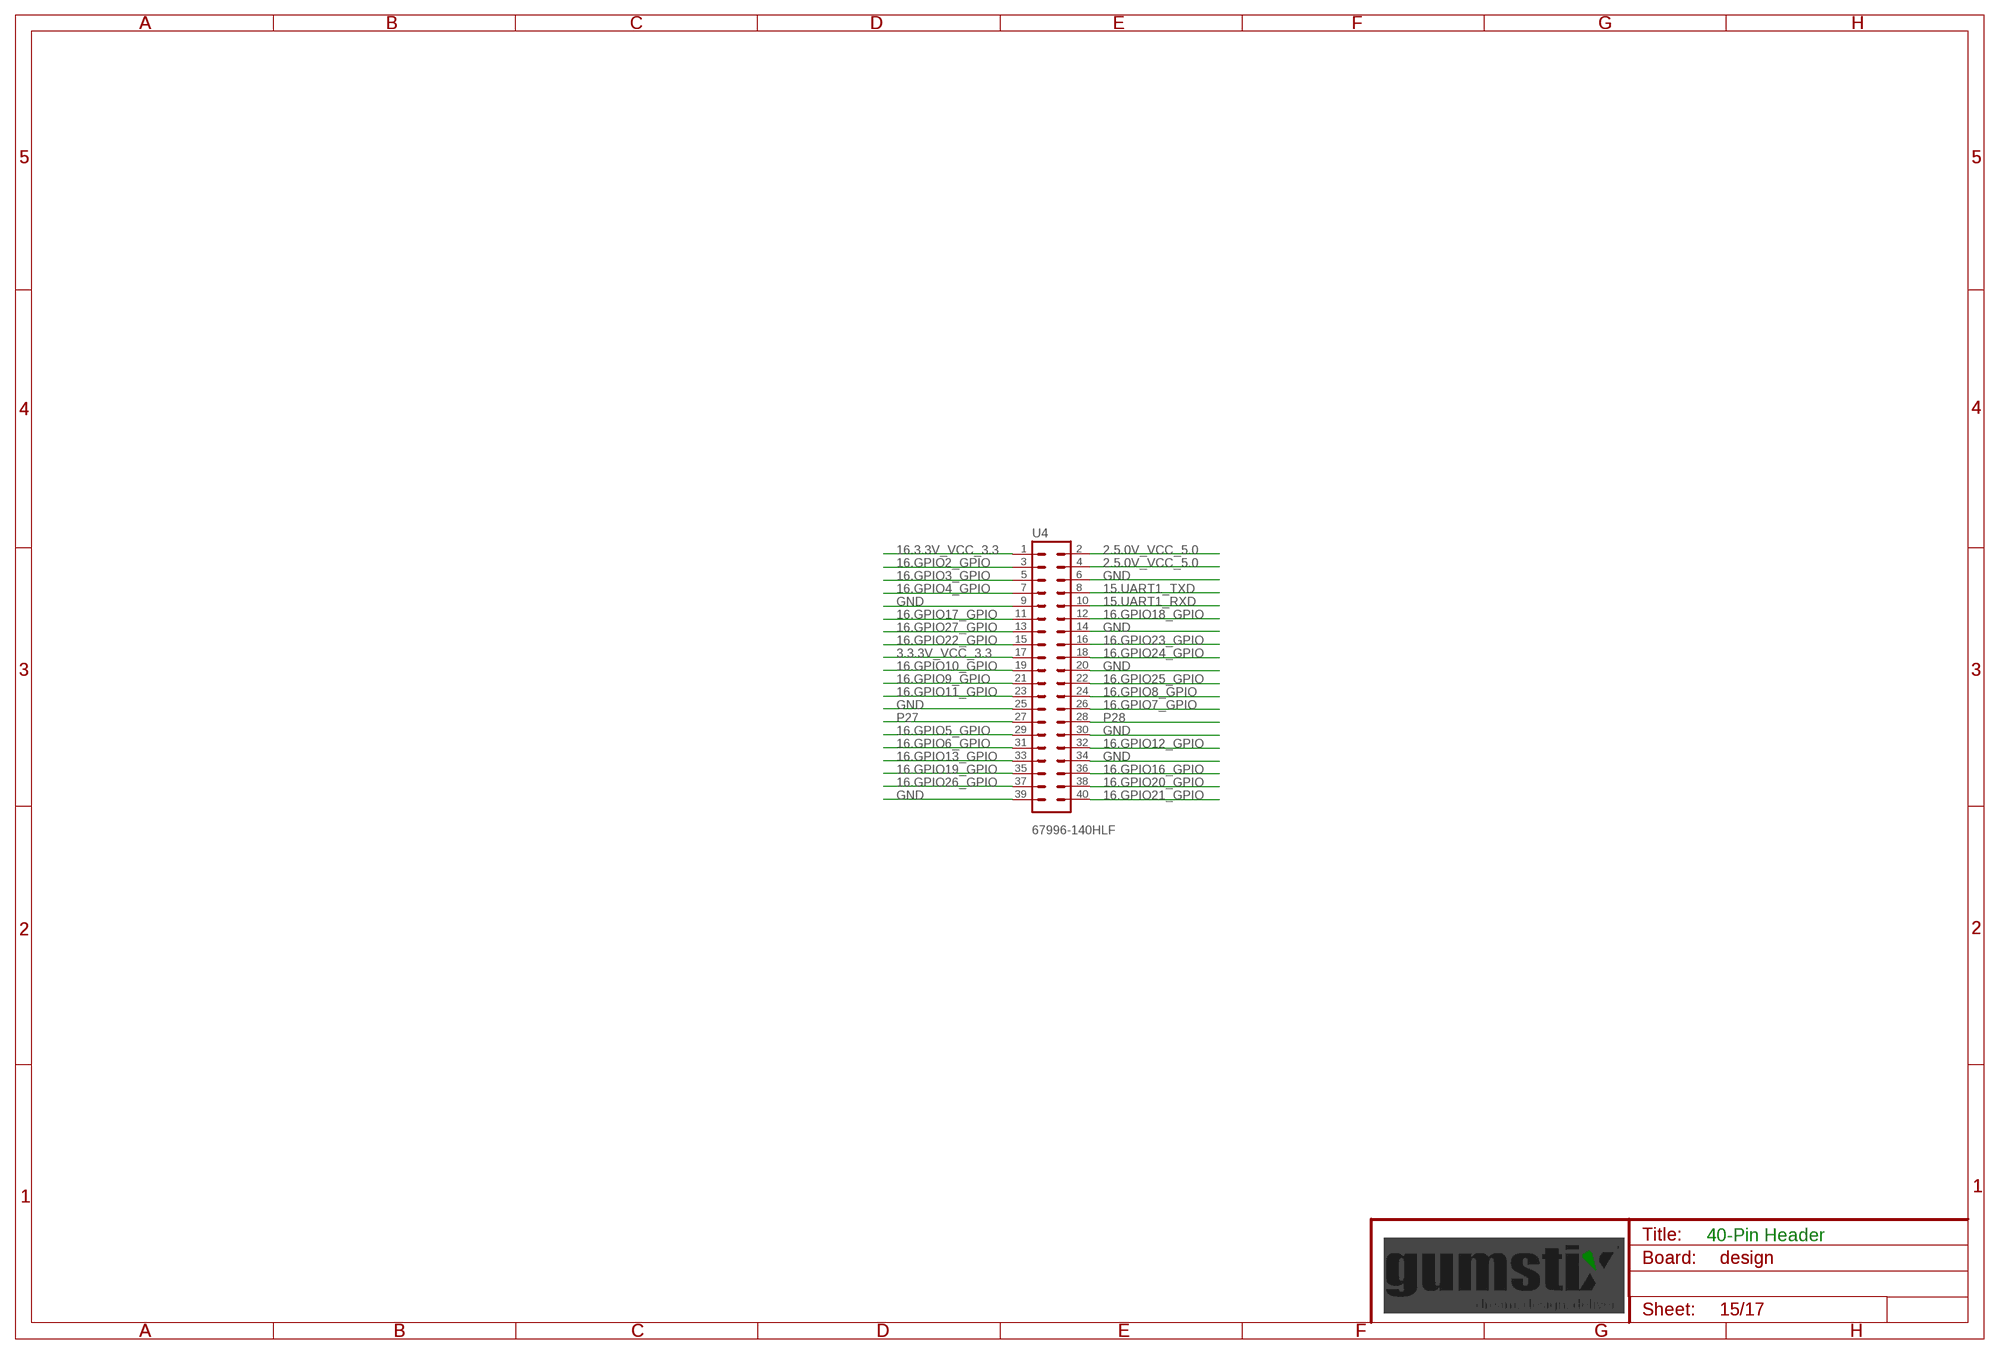
[diagram p14: schematic, sheet 15]

### Parts
U4  67996-140HLF  [2X20]

### Nets
2.5.0V_VCC_5.0 [supply]: U4.2 U4.4 ; also sheet 3,4,11,13,16,17
3.3.3V_VCC_3.3 [supply]: U4.17 ; also sheet 4,6,9,10
15.UART1_RXD: U4.10 ; also sheet 12
15.UART1_TXD: U4.8 ; also sheet 12
16.3.3V_VCC_3.3 [supply]: U4.1 ; also sheet 13,17
16.GPIO2_GPIO: U4.3 ; also sheet 13
16.GPIO3_GPIO: U4.5 ; also sheet 13
16.GPIO4_GPIO: U4.7 ; also sheet 13
16.GPIO5_GPIO: U4.29 ; also sheet 13
16.GPIO6_GPIO: U4.31 ; also sheet 13
16.GPIO7_GPIO: U4.26 ; also sheet 13
16.GPIO8_GPIO: U4.24 ; also sheet 13
16.GPIO9_GPIO: U4.21 ; also sheet 13
16.GPIO10_GPIO: U4.19 ; also sheet 13
16.GPIO11_GPIO: U4.23 ; also sheet 13
16.GPIO12_GPIO: U4.32 ; also sheet 13
16.GPIO13_GPIO: U4.33 ; also sheet 13
16.GPIO16_GPIO: U4.36 ; also sheet 13
16.GPIO17_GPIO: U4.11 ; also sheet 13
16.GPIO18_GPIO: U4.12 ; also sheet 13
16.GPIO19_GPIO: U4.35 ; also sheet 13
16.GPIO20_GPIO: U4.38 ; also sheet 13
16.GPIO21_GPIO: U4.40 ; also sheet 13
16.GPIO22_GPIO: U4.15 ; also sheet 13
16.GPIO23_GPIO: U4.16 ; also sheet 9,13
16.GPIO24_GPIO: U4.18 ; also sheet 13
16.GPIO25_GPIO: U4.22 ; also sheet 13
16.GPIO26_GPIO: U4.37 ; also sheet 13
16.GPIO27_GPIO: U4.13 ; also sheet 13
GND [supply]: U4.6 U4.9 U4.14 U4.20 U4.25 U4.30 U4.34 U4.39 ; also sheet 2,3,4,5,6,7,8,9,10,11,12,13,14,16,17
P27: U4.27
P28: U4.28

### Notes on the sheet
- 40-Pin Header

## Sheet 16 of 17
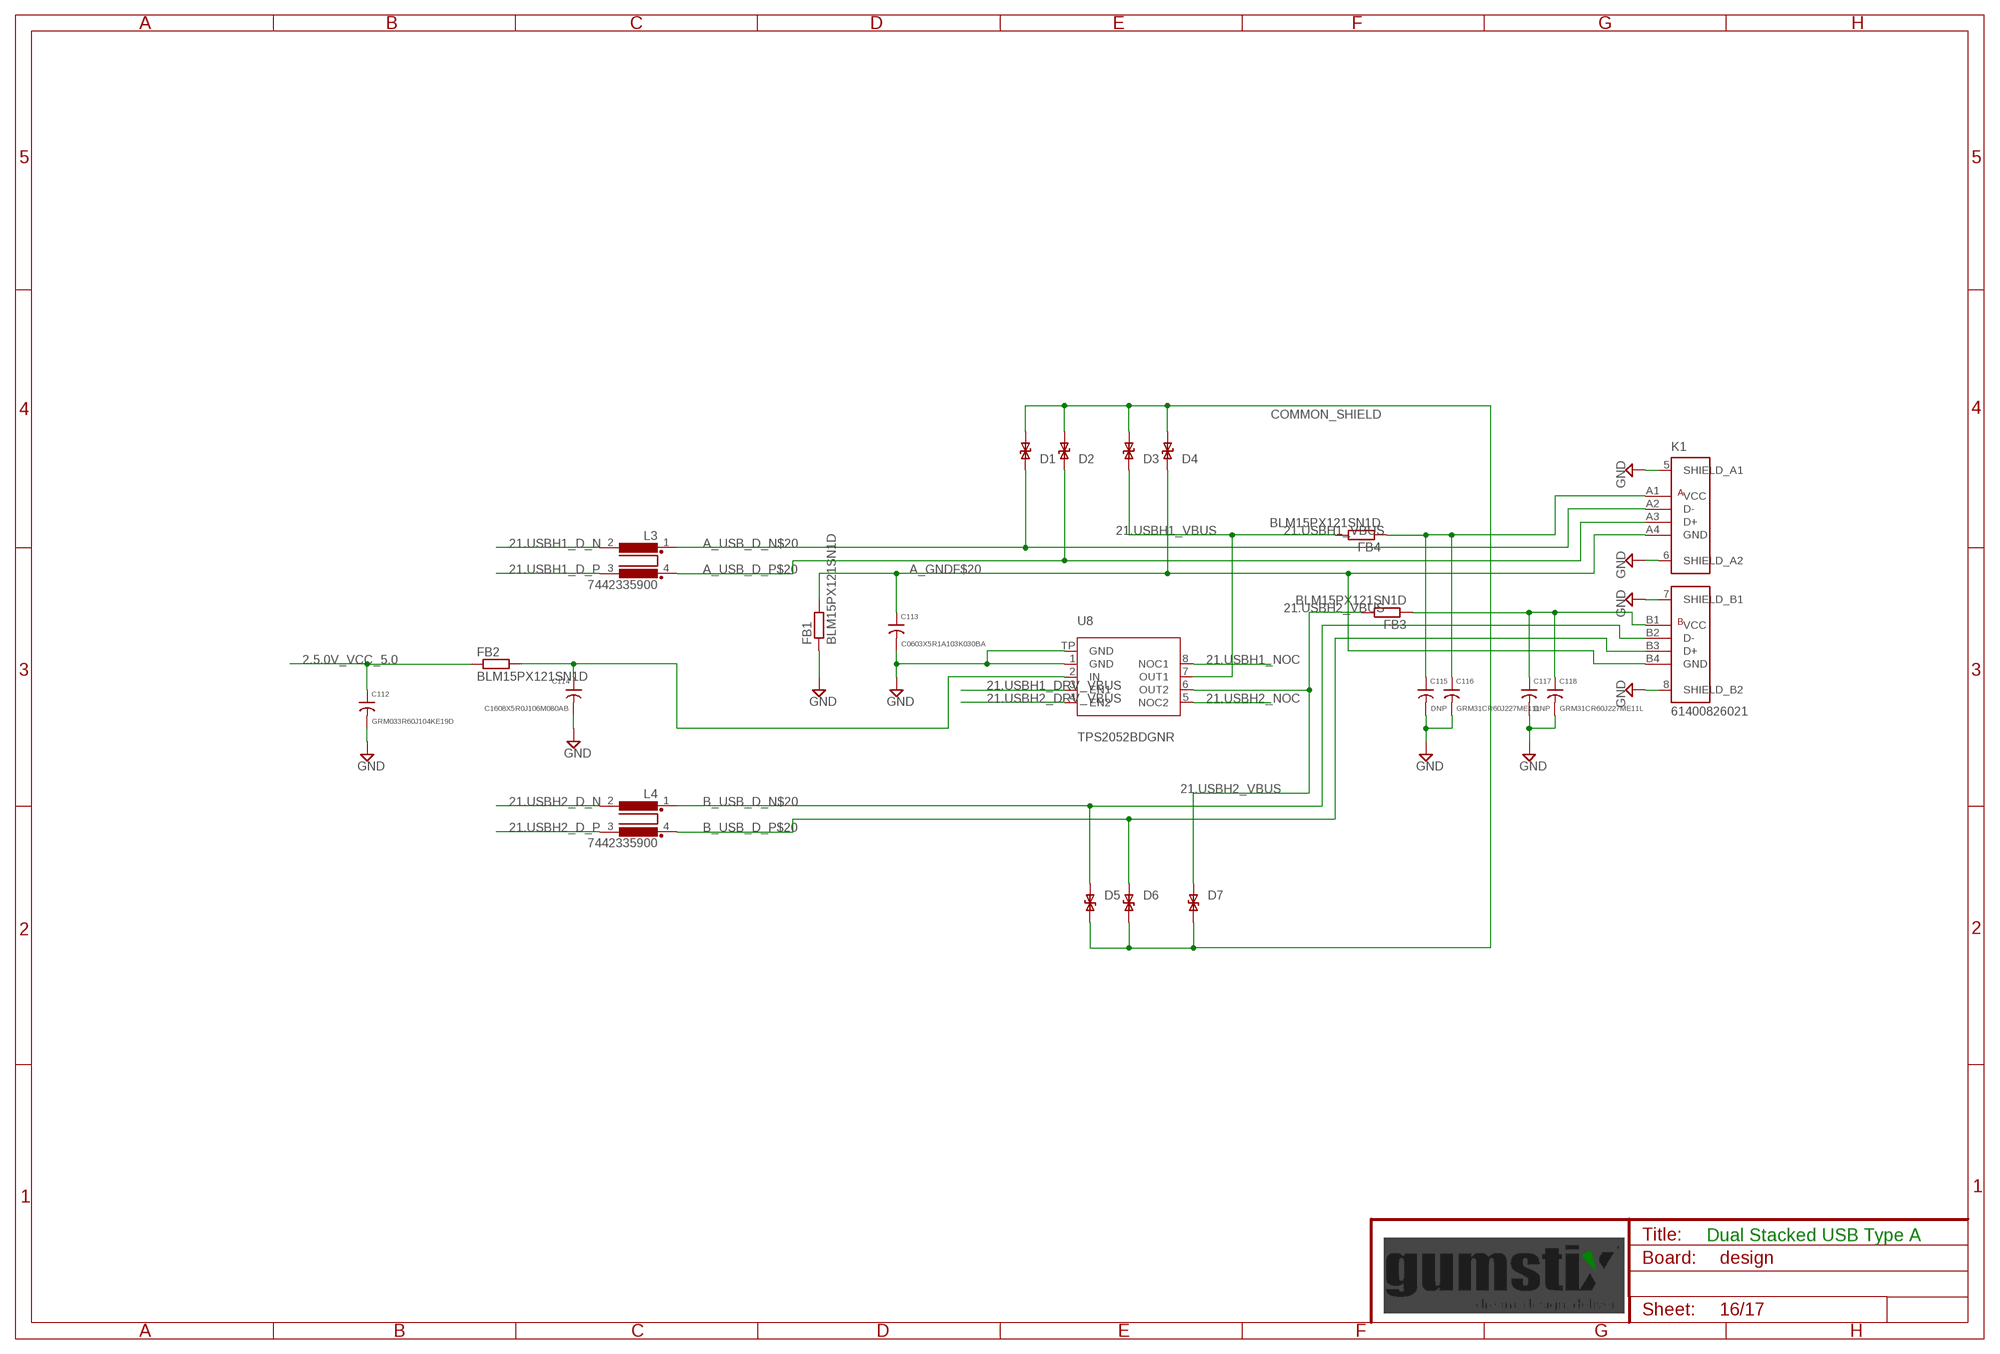
[diagram p15: schematic, sheet 16]

### Parts
C112  GRM033R60J104KE19D  [0201]
C113  C0603X5R1A103K030BA  [0201]
C114  C1608X5R0J106M080AB  [0603]
C115  DNP  C1206  [1206]
C116  GRM31CR60J227ME11L  [1206]
C117  DNP  C1206  [1206]
C118  GRM31CR60J227ME11L  [1206]
D1  PS04LTVA1  [D0402]
D2  PS04LTVA1  [D0402]
D3  B72590D0050A060  [D0402]
D4  B72590D0050A060  [D0402]
D5  PS04LTVA1  [D0402]
D6  PS04LTVA1  [D0402]
D7  B72590D0050A060  [D0402]
FB1  BLM15PX121SN1D  [0402]
FB2  BLM15PX121SN1D  [0402]
FB3  BLM15PX121SN1D  [0402]
FB4  BLM15PX121SN1D  [0402]
K1  61400826021  [61400826021]
L3  7442335900  [0504-DLP11S]
L4  7442335900  [0504-DLP11S]
U8  TPS2052BDGNR  [MSOP8-PAD]

### Nets
2.5.0V_VCC_5.0 [supply]: C112.1 FB2.1 ; also sheet 3,4,11,13,15,17
21.USBH1_D_N [USB]: L3.2 ; also sheet 17
21.USBH1_D_P [USB]: L3.3 ; also sheet 17
21.USBH1_DRV_VBUS: U8.3(EN1) ; also sheet 17
21.USBH1_NOC: U8.8(NOC1) ; also sheet 17
21.USBH1_VBUS [supply]: D3.P2 FB4.2 U8.7(OUT1) ; also sheet 17
21.USBH2_D_N [USB]: L4.2 ; also sheet 17
21.USBH2_D_P [USB]: L4.3 ; also sheet 17
21.USBH2_DRV_VBUS: U8.4(EN2) ; also sheet 17
21.USBH2_NOC: U8.5(NOC2) ; also sheet 17
21.USBH2_VBUS [supply]: D7.P2 FB3.2 U8.6(OUT2) ; also sheet 17
A_GNDF$20 [supply]: C113.1 D4.P2 FB1.2 K1.A4(GND) K1.B4(GND)
A_USB_D_N$20 [USB]: D1.P2 K1.A2(D-) L3.1
A_USB_D_P$20 [USB]: D2.P2 K1.A3(D+) L3.4
A_VBUS_$20 [supply]: C115.1 C116.1 FB4.1 K1.A1(VCC)
B_USB_D_N$20 [USB]: D5.P2 K1.B2(D-) L4.1
B_USB_D_P$20 [USB]: D6.P2 K1.B3(D+) L4.4
B_VBUS_$20 [supply]: C117.1 C118.1 FB3.1 K1.B1(VCC)
COMMON_SHIELD [supply]: D1.P1 D2.P1 D3.P1 D4.P1 D5.P1 D6.P1 D7.P1 ; also sheet 5,11
GND [supply]: C112.2 C113.2 C114.2 C115.2 C116.2 C117.2 C118.2 FB1.1 K1.5(SHIELD_A1) K1.6(SHIELD_A2) K1.7(SHIELD_B1) K1.8(SHIELD_B2) U8.1(GND) U8.TP(GND) ; also sheet 2,3,4,5,6,7,8,9,10,11,12,13,14,15,17
VBUSF$20 [supply]: C114.1 FB2.2 U8.2(IN)

### Notes on the sheet
- Dual Stacked USB Type A

## Sheet 17 of 17
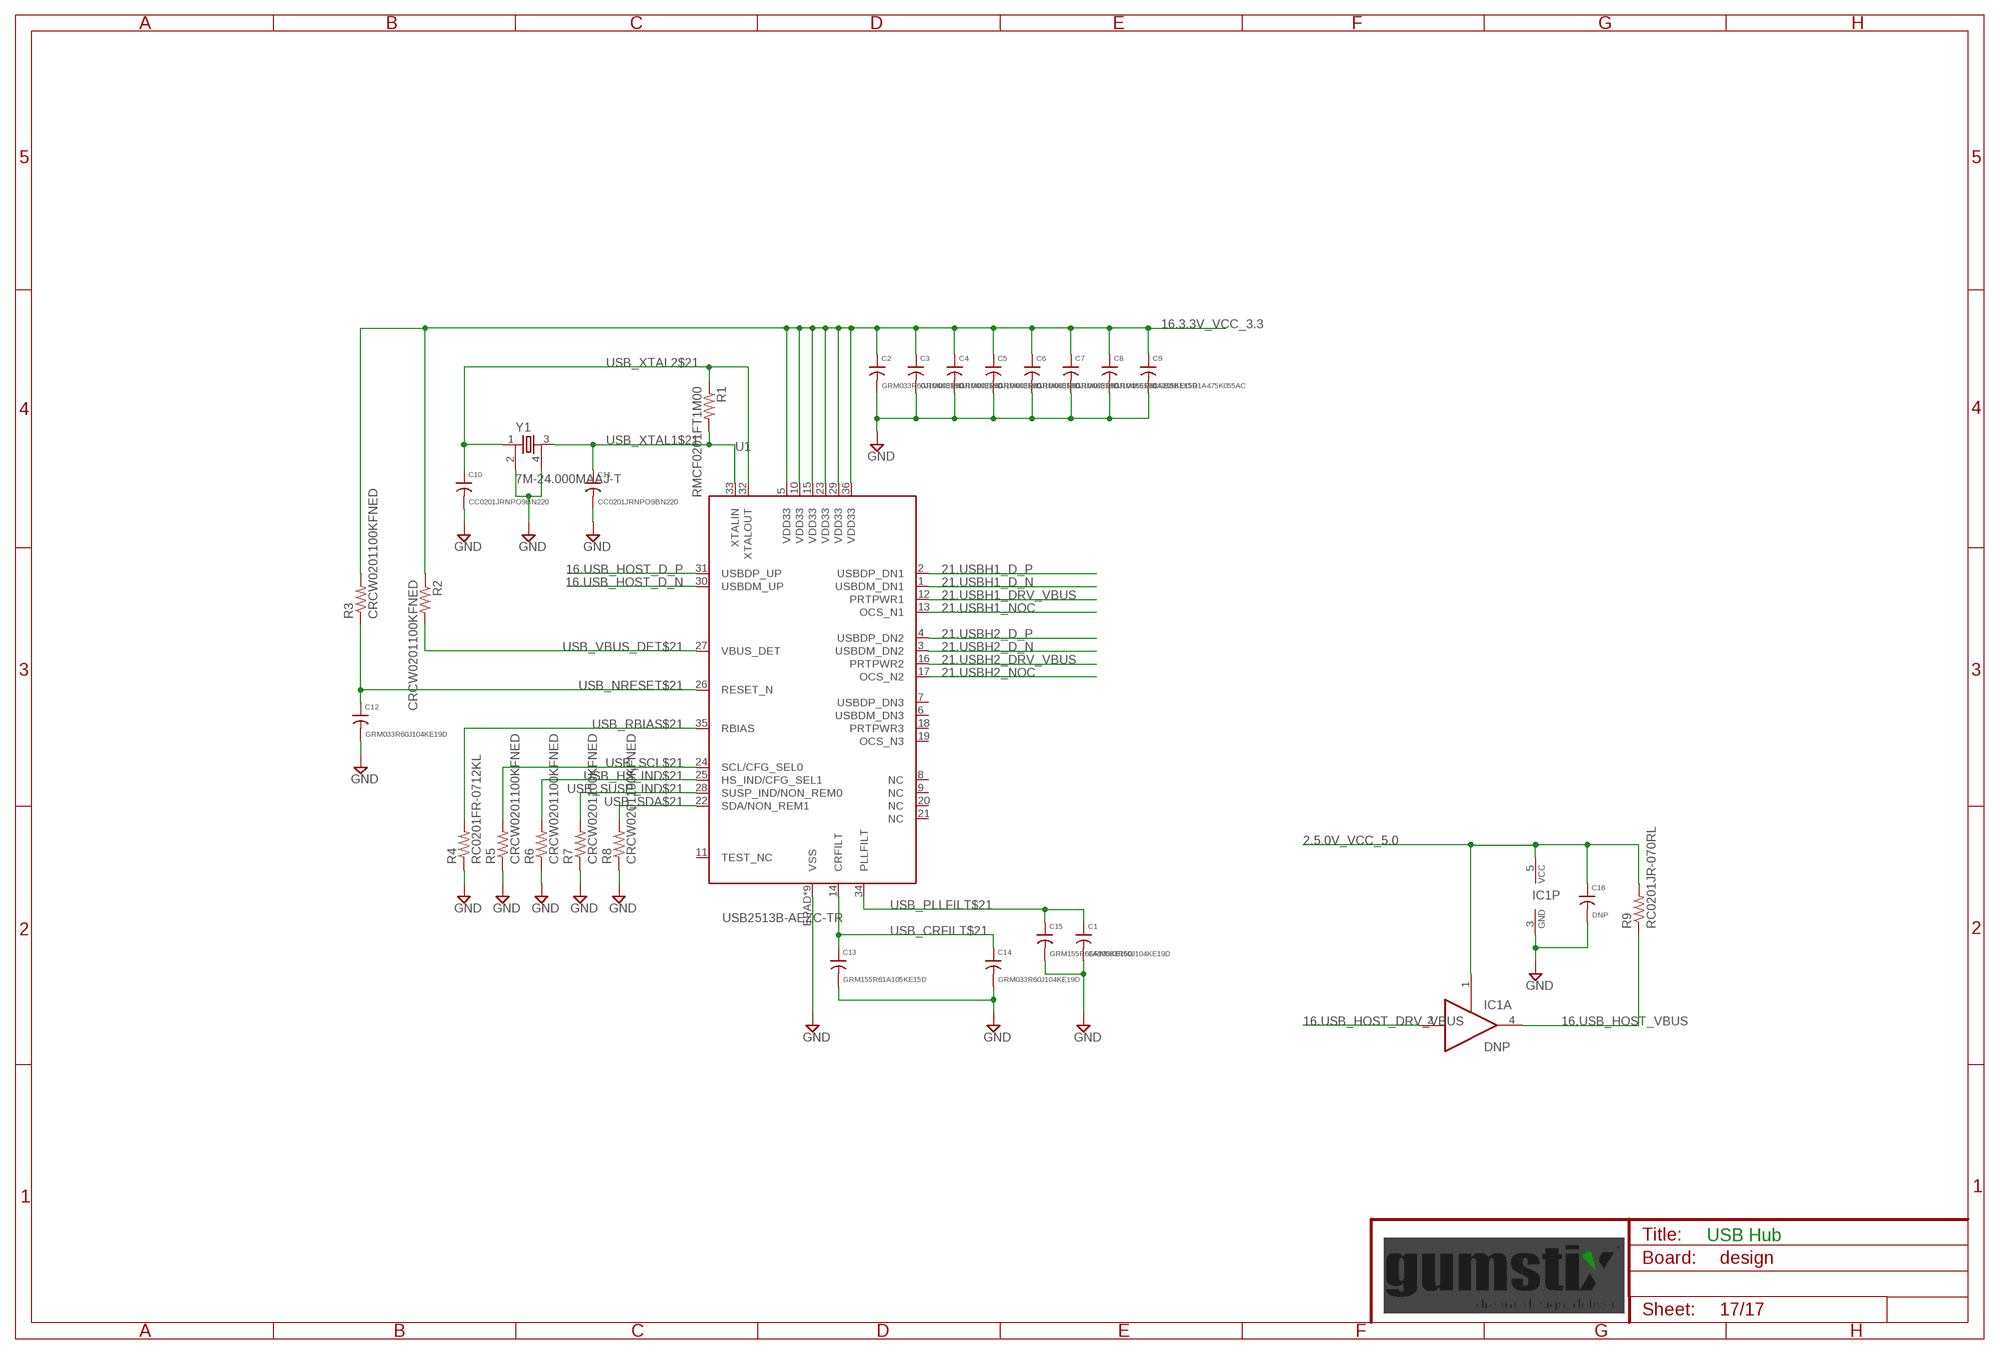
[diagram p16: schematic, sheet 17]

### Parts
C1  GRM033R60J104KE19D  [0201]
C2  GRM033R60J104KE19D  [0201]
C3  GRM033R60J104KE19D  [0201]
C4  GRM033R60J104KE19D  [0201]
C5  GRM033R60J104KE19D  [0201]
C6  GRM033R60J104KE19D  [0201]
C7  GRM033R60J104KE19D  [0201]
C8  GRM155R61A105KE15D  [0402]
C9  CGB3B1X5R1A475K055AC  [0603]
C10  CC0201JRNPO9BN220  [0201]
C11  CC0201JRNPO9BN220  [0201]
C12  GRM033R60J104KE19D  [0201]
C13  GRM155R61A105KE15D  [0402]
C14  GRM033R60J104KE19D  [0201]
C15  GRM155R61A105KE15D  [0402]
C16  DNP  C0402  [0402]
IC1  DNP  SN74LVC1G126DCKR  [SC70-5]
R1  RMCF0201FT1M00  [0201]
R2  CRCW0201100KFNED  [0201]
R3  CRCW0201100KFNED  [0201]
R4  RC0201FR-0712KL  [0201]
R5  CRCW0201100KFNED  [0201]
R6  CRCW0201100KFNED  [0201]
R7  CRCW0201100KFNED  [0201]
R8  CRCW0201100KFNED  [0201]
R9  RC0201JR-070RL  [0201]
U1  USB2513B-AEZC-TR  [QFN36-6X6MM]
Y1  7M-24.000MAAJ-T  [CRYSTAL-3225]

### Nets
2.5.0V_VCC_5.0 [supply]: C16.1 IC1.1(A:OE) IC1.5(P:VCC) R9.2 ; also sheet 3,4,11,13,15,16
16.3.3V_VCC_3.3 [supply]: C2.1 C3.1 C4.1 C5.1 C6.1 C7.1 C8.1 C9.1 R2.1 R3.2 U1.5(VDD33) U1.10(VDD33) U1.15(VDD33) U1.23(VDD33) U1.29(VDD33) U1.36(VDD33) ; also sheet 13,15
16.USB_HOST_D_N [USB]: U1.30(USBDM_UP) ; also sheet 13
16.USB_HOST_D_P [USB]: U1.31(USBDP_UP) ; also sheet 13
16.USB_HOST_DRV_VBUS: IC1.2(A:I) ; also sheet 13
16.USB_HOST_VBUS: IC1.4(A:O) R9.1 ; also sheet 13
21.USBH1_D_N [USB]: U1.1(USBDM_DN1) ; also sheet 16
21.USBH1_D_P [USB]: U1.2(USBDP_DN1) ; also sheet 16
21.USBH1_DRV_VBUS: U1.12(PRTPWR1) ; also sheet 16
21.USBH1_NOC: U1.13(OCS_N1) ; also sheet 16
21.USBH2_D_N [USB]: U1.3(USBDM_DN2) ; also sheet 16
21.USBH2_D_P [USB]: U1.4(USBDP_DN2) ; also sheet 16
21.USBH2_DRV_VBUS: U1.16(PRTPWR2) ; also sheet 16
21.USBH2_NOC: U1.17(OCS_N2) ; also sheet 16
GND [supply]: C1.2 C2.2 C3.2 C4.2 C5.2 C6.2 C7.2 C8.2 C9.2 C10.2 C11.2 C12.2 C13.2 C14.2 C15.2 C16.2 IC1.3(P:GND) R4.1 R5.1 R6.1 R7.1 R8.1 U1.EPAD(VSS) U1.EXP1(VSS) U1.EXP2(VSS) U1.EXP3(VSS) U1.EXP4(VSS) U1.EXP5(VSS) U1.EXP6(VSS) U1.EXP7(VSS) U1.EXP8(VSS) Y1.2 Y1.4 ; also sheet 2,3,4,5,6,7,8,9,10,11,12,13,14,15,16
USB_CRFILT$21: C13.1 C14.1 U1.14(CRFILT)
USB_HS_IND$21: R6.2 U1.25(HS_IND/CFG_SEL1)
USB_NRESET$21: C12.1 R3.1 U1.26(RESET_N)
USB_PLLFILT$21: C1.1 C15.1 U1.34(PLLFILT)
USB_RBIAS$21: R4.2 U1.35(RBIAS)
USB_SCL$21: R5.2 U1.24(SCL/CFG_SEL0)
USB_SDA$21: R8.2 U1.22(SDA/NON_REM1)
USB_SUSP_IND$21: R7.2 U1.28(SUSP_IND/NON_REM0)
USB_VBUS_DET$21: R2.2 U1.27(VBUS_DET)
USB_XTAL1$21: C11.1 R1.2 U1.33(XTALIN) Y1.3
USB_XTAL2$21: C10.1 R1.1 U1.32(XTALOUT) Y1.1
Unconnected: U1.6(USBDM_DN3) U1.7(USBDP_DN3) U1.8(NC) U1.9(NC) U1.11(TEST_NC) U1.18(PRTPWR3) U1.19(OCS_N3) U1.20(NC) U1.21(NC)

### Notes on the sheet
- USB Hub

## Library data of the parts
C1-C7 C12 C14 C112 = qualified_1:GRM033R60J104KE19D; DM: 0; DR: 90.000; DX: 5.600; DY: 28.400; HEIGHT: 0.25; SHEETNO: 2
C8 C13 C15 C87 = qualified_1:GRM155R61A105KE15D; HEIGHT: 0.35
C9 C81 = qualified_1:CGB3B1X5R1A475K055AC; DM: 0; DR: 0.000; DX: 66.900; DY: 11.100; HEIGHT: 0.5; SHEETNO: 4
C10 = qualified_1:CC0201JRNPO9BN220; DM: 0; DR: -270.000; DX: -17.200; DY: 6.600; HEIGHT: 0.25; SHEETNO: 9
C11 = qualified_1:CC0201JRNPO9BN220; DM: 0; DR: -90.000; DX: -20.800; DY: 6.600; HEIGHT: 0.25; SHEETNO: 9
C16 = qualified_1:C; DM: 0; DR: 90.000; DX: 5.600; DY: 28.400; HEIGHT: 0.35; SHEETNO: 2
C17 C89 C93 C97-C99 C102 C105-C107 C109 C119 = qualified_1:GRM033R60J104KE19D; HEIGHT: 0.25
C18 C88 C96 C100 = qualified_1:C1608X5R0J106M080AB; HEIGHT: 0.5
C30 = qualified_1:C0603C103K5RACTU; HEIGHT: 0.5
C52 C78 C108 = qualified_1:C0603X5R1A103K030BA; HEIGHT: 0.25
C79 = qualified_1:EEE-1CA331UP
C80 C82 = qualified_1:GRM033R60J104KE19D; DM: 0; DR: 90.000; DX: 64.700; DY: 10.600; HEIGHT: 0.25; SHEETNO: 4
C83 = qualified_1:GRM033R60J104KE19D; DM: 0; DR: 0.000; DX: 58.600; DY: 19.050; HEIGHT: 0.25; SHEETNO: 4
C84 = qualified_1:GRM033R60J104KE19D; DM: 0; DR: 0.000; DX: 66.300; DY: 12.650; HEIGHT: 0.25; SHEETNO: 4
C85 = qualified_1:EMK105B7104KV-F; DM: 0; DR: -90.000; DX: 1.400; DY: -9.000; HEIGHT: 0.35; SHEETNO: 9
C86 = qualified_1:EMK212BJ106KG-T; DM: 0; DR: 0.000; DX: 74.600; DY: 25.600; HEIGHT: 0.51; SHEETNO: 1
C90 C115 C117 = qualified_1:C; HEIGHT: 0.51
C91 = qualified_1:UMK063CG100DT-F; HEIGHT: 0.25
C92 = qualified_1:CL21A226MQCLQNC; DM: 0; DR: 270.000; DX: 71.300; DY: 21.800; HEIGHT: 0.51; SHEETNO: 1
C94 C95 = qualified_1:C0603C0G1H470J030BA; HEIGHT: 0.25
C101 C111 = qualified_1:GRM033R60J104KE19D; DM: 0; DR: 0.000; DX: 30.550; DY: 33.500; HEIGHT: 0.25; SHEETNO: 6
C103 C104 = qualified_1:C0603X5R1A103K030BA; DM: 0; DR: 0.000; DX: 30.550; DY: 33.500; HEIGHT: 0.25; SHEETNO: 6
C110 = qualified_1:CL31A106KBHNNNE; HEIGHT: 0.51
C113 = qualified_1:C0603X5R1A103K030BA; DM: 0; DR: 90.000; DX: 47.400; DY: 38.400; HEIGHT: 0.25; SHEETNO: 2
C114 = qualified_1:C1608X5R0J106M080AB; DM: 0; DR: 90.000; DX: 56.200; DY: 38.400; HEIGHT: 0.5; SHEETNO: 2
C116 C118 = qualified_1:GRM31CR60J227ME11L; HEIGHT: 0.51
D1 D2 D5 D6 = qualified_1:PS04LTVA1; HEIGHT: 0.35
D3 D4 D7 D12 D13 = qualified_1:B72590D0050A060; HEIGHT: 0.35
D8 = qualified_1:150060GS75000; HEIGHT: 0.5
D9 = qualified_1:TPD1E10B06
D10 = qualified_1:CDBC540-G: Schottky Diode
D11 = qualified_1:824501401
D14 = qualified_1:150060RS75000; HEIGHT: 0.5
FB1 FB3 FB4 = qualified_1:BLM15PX121SN1D; DM: 0; DR: 90.000; DX: 49.400; DY: 38.400; HEIGHT: 0.35; SHEETNO: 2
FB2 = qualified_1:BLM15PX121SN1D; DM: 0; DR: 90.000; DX: 54.000; DY: 38.400; HEIGHT: 0.35; SHEETNO: 2
FB5 = qualified_1:BLM15PX121SN1D; DM: 0; DR: 0.000; DX: 56.400; DY: 28.200; HEIGHT: 0.35; SHEETNO: 2
IC1 = qualified_1:SN74LVC1G126: Single Bus Buffer Gate With 3-State Outputs; HEIGHT: 1.1
IC2 = qualified_1:FT232RQ-REEL: Source: http://www.ftdichip.com/Documents/DataSheets/DS_FT232R_v104.pdf; DM: 0; DR: 0.000; DX: 61.700; DY: 13.850; HEIGHT: 0.9; MPN: FT232RQ; OC_FARNELL: 1146033; OC_NEWARK: 91K9919; SHEETNO: 4
IC3 = qualified_1:SN74LV1T126DCKR: Single Bus Buffer Gate With 3-State Outputs; DM: 0; DR: 90.000; DX: 58.050; DY: 17.100; HEIGHT: 1.1; SHEETNO: 4
IC4 = qualified_1:TPS62111; DM: 0; DR: 180.000; DX: 74.800; DY: 22.000; HEIGHT: 1; SHEETNO: 1
IC5 = qualified_1:CAT24C256YI-GT3: 2-wire serial EEPROM; HEIGHT: 1
J1 J2 = qualified_1:DF40C-100DS-0.4V(51): DF40 Series 100 Position Dual Row 0.4 mm Pitch Surface Mount Vertical Receptacle; DESCRIPTION: DF40 Series 100 Position Dual Row 0.4 mm Pitch Surface Mount Vertical Receptacle; DIGI-KEY_PART_NUMBER: H11615CT-ND; DIGI-KEY_PURCHASE_URL: https://www.digikey.ca/product-detail/en/hirose-electric-co-ltd/DF40C-100DS-0.4V_51_/H11615CT-ND/1969495?utm_source=snapeda&utm_medium=aggregator&utm_campaign=symbol; MF: Hirose; MP: DF40C-100DS-0.4V_51_; PACKAGE: None
J3 = qualified_1:PJ-002AH
K1 = qualified_1:61400826021: WR-COM Horizontal Dual Stacked USB Type A
L1-L4 L7 L8 = qualified_1:7442335900; HEIGHT: 0.83
L5 = qualified_1:LQH44PN6R8MP0L; HEIGHT: 1.9
L6 = qualified_1:IHLP3232DZER100M11; DM: 0; DR: 180.000; DX: 76.000; DY: 17.000; SHEETNO: 1
MP1-MP4 = qualified_1:9774015151R: Bullet connector (for RC) solder pad.
MP5 = qualified_1:BULLET_CONN: Bullet connector (for RC) solder pad.
Q1 Q4 Q6 = qualified_1:BSS138: N-Channel Enhancement MOSFET; HEIGHT: 1.12
Q2 Q3 = qualified_1:FDN360P; HEIGHT: 1.12
Q5 = qualified_1:KC2520B32K7680CM2E00: CRYSTAL CLOCK OSCILLATORS 5.0 Vdc or 3.3 Vdc - LOW PROFILE ULTRA MINIATURE CERAMIC SURFACE MOUNT Source: http://www.abracon.com/Oscillators/asf1-L-L1.pdf
R1 = qualified_1:RMCF0201FT1M00; DM: 0; DR: -270.000; DX: -20.800; DY: 8.200; HEIGHT: 0.25; SHEETNO: 9
R2 R3 R5-R8 R12 = qualified_1:CRCW0201100KFNED; DM: 0; DR: -270.000; DX: -20.800; DY: 8.200; HEIGHT: 0.25; SHEETNO: 9
R4 = qualified_1:RC0201FR-0712KL; DM: 0; DR: -270.000; DX: -20.800; DY: 8.200; HEIGHT: 0.25; SHEETNO: 9
R9 = qualified_1:RC0201JR-070RL; DM: 0; DR: -270.000; DX: -20.800; DY: 8.200; HEIGHT: 0.25; SHEETNO: 9
R10 R45 = qualified_1:RC0201FR-071K5L; HEIGHT: 0.25
R11 R22 R25 R33 R40 = qualified_1:ERJ-1GEF1002C; HEIGHT: 0.25
R17 = qualified_1:ERJ-2RKF3162X; DM: 0; DR: -270.000; DX: -20.800; DY: 8.200; HEIGHT: 0.35; SHEETNO: 9
R18 = qualified_1:MCR10EZPJ000; HEIGHT: 0.51
R19 = qualified_1:RMCF0201FT1M00; HEIGHT: 0.25
R20 = qualified_1:311-330GRTR-ND; HEIGHT: 0.5
R21 = qualified_1:MCR01MRTJ000; DM: 0; DR: 270.000; DX: 72.800; DY: 18.400; HEIGHT: 0.35; SHEETNO: 1
R23 R26 = qualified_1:ERJ-1GEF1500C; HEIGHT: 0.25
R24 = qualified_1:R; DM: 0; DR: 270.000; DX: 72.800; DY: 18.400; HEIGHT: 0.35; SHEETNO: 1
R27 R35 = qualified_1:ERJ-1GNJ102C; HEIGHT: 0.25
R28 R31 = qualified_1:ERJ-2RKF3000X; HEIGHT: 0.35
R29 R30 R41-R43 = qualified_1:CRCW0201100KFNED; HEIGHT: 0.25
R32 = qualified_1:CRCW040275R0FKED; HEIGHT: 0.35
R34 R36 R38 R39 R44 = qualified_1:RC0201JR-070RL; HEIGHT: 0.25
R37 = qualified_1:R; HEIGHT: 0.25
RP1 RP2 = qualified_1:RP741X083
RP3 = qualified_1:RP741X083; HEIGHT: 0.4
S1 = qualified_1:KMT021-NGJ-LHS
S2 S3 = qualified_1:EVQ-PLDA15; HEIGHT: 2
TP1 = qualified_1:TP; HEIGHT: 0
U1 = qualified_1:USB2513B-AEZC-TR; HEIGHT: 1
U2 = qualified_1:TS3A5223RSWR: TS3A5223 0.45Ω Dual SPDT Bidirectional Analog Switch Package: UQFN-10 Source: http://www.ti.com/lit/ds/symlink/ts3a5223.pdf
U3 = qualified_1:685119134923; HEIGHT: 6.2
U4 = qualified_1:67996-140HLF
U5 = qualified_1:TPD13S523PWR: TPD13S523 13-Channel ESD Protection Solution With Current-Limit Load Switch For HDMI Transmitter Ports http://www.ti.com/lit/ds/symlink/tpd13s523.pdf
U6 = qualified_1:TPS5450QDDARQ1
U7 = qualified_1:1-2199230-5
U8 = qualified_1:TPS2052BDGNR; HEIGHT: 1.1
U$26 = qualified_1:TXS0104ERGYR: 4-bit Bidirectional Level Translator http://www.ti.com/lit/ds/symlink/txs0104e.pdf
Y1 = qualified_1:7M-24.000MAAJ-T; HEIGHT: 0.8

## Net classes
1 supply: width 0.254 mm
2 analog: width 0.178 mm
5 USB: width 0.2 mm, clearance 0.2 mm
6 HDMI: width 0.2 mm, clearance 0.3 mm
7 50_OHM: width 0.378 mm, clearance 0.3 mm
4 xxwide: width 0.203 mm